# EAGLE design controller_board (EAGLE 9.6.2)
Assembly variants: Minimal, FullAwesome
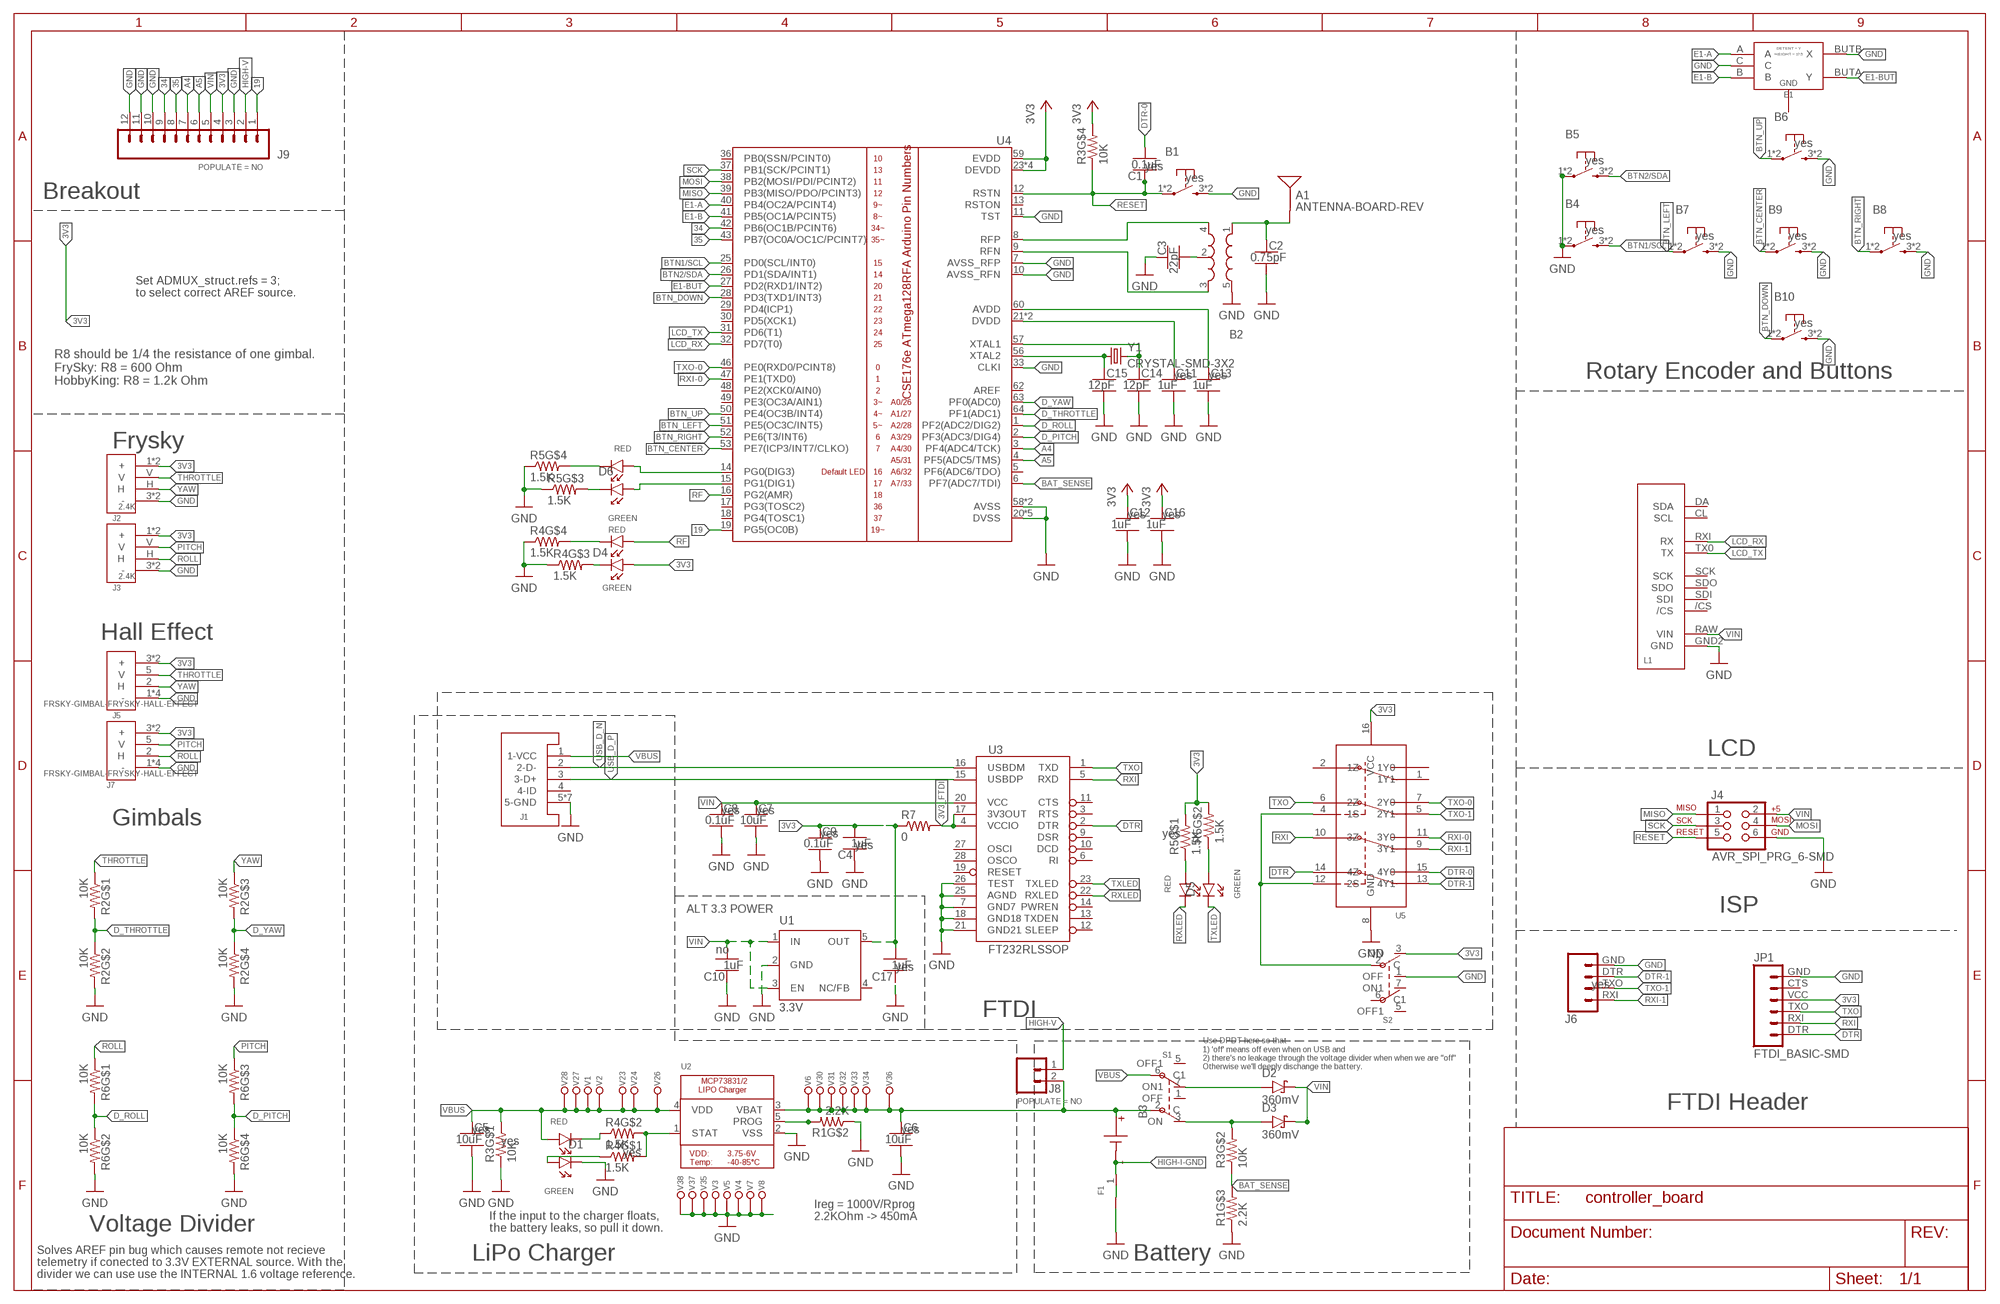
[diagram p0: schematic, sheet 1]
FRAME1 (FRAME_B_L): CREATOR: Unknown; DIST: Unknown; DISTPN: Unknown

## Parts
A1  ANTENNA-BOARD-REV  [ANT_PCB_2.4GHZ_NRF8001_1.6MM_1OZ_REV]
B1  PUSHBUTTON_-4.5X4.5  [4.5MM_TACTILE_SWITCH_TL3305AF160QG]
B2  BALUN0805  [BALUN]
B3  BATTERY-SCREW-TERMINAL  [SCREW-TERMINAL-1X2-2.54MM]
B4  PUSHBUTTON_-4.5X4.5  [4.5MM_TACTILE_SWITCH_TL3305AF160QG]  (not fitted in variant Minimal)
B5  PUSHBUTTON_-4.5X4.5  [4.5MM_TACTILE_SWITCH_TL3305AF160QG]  (not fitted in variant Minimal)
B6  PUSHBUTTON_-4.5X4.5  [4.5MM_TACTILE_SWITCH_TL3305AF160QG]
B7  PUSHBUTTON_-4.5X4.5  [4.5MM_TACTILE_SWITCH_TL3305AF160QG]
B8  PUSHBUTTON_-4.5X4.5  [4.5MM_TACTILE_SWITCH_TL3305AF160QG]
B9  PUSHBUTTON_-4.5X4.5  [4.5MM_TACTILE_SWITCH_TL3305AF160QG]
B10  PUSHBUTTON_-4.5X4.5  [4.5MM_TACTILE_SWITCH_TL3305AF160QG]
C1  0.1uF  CAPACITOR-NP_SMD-0603_CERAMIC-0.1UF  [CAPC1608X100]
C2  0.75pF  CAPACITOR-NP_SMD-0603_CERAMIC-0.75PF  [CAPC1608X100]
C3  22pF  CAPACITOR-NP_SMD-0603_CERAMIC-22PF  [CAPC1608X100]
C4  1uF  CAPACITOR-NP_SMD-0603_CERAMIC-1UF  [CAPC1608X100]
C5  10uF  CAPACITOR-NP_SMD-0603_CERAMIC-10UF  [CAPC1608X100]
C6  10uF  CAPACITOR-NP_SMD-0603_CERAMIC-10UF  [CAPC1608X100]
C7  10uF  CAPACITOR-NP_SMD-0603_CERAMIC-10UF  [CAPC1608X100]  (not fitted in variant Minimal)
C8  0.1uF  CAPACITOR-NP_SMD-0603_CERAMIC-0.1UF  [CAPC1608X100]  (not fitted in variant Minimal)
C9  0.1uF  CAPACITOR-NP_SMD-0603_CERAMIC-0.1UF  [CAPC1608X100]  (not fitted in variant Minimal)
C10  1uF  CAPACITOR-NP_SMD-0603_CERAMIC-1UF  [CAPC1608X100]
C11  1uF  CAPACITOR-NP_SMD-0603_CERAMIC-1UF  [CAPC1608X100]
C12  1uF  CAPACITOR-NP_SMD-0603_CERAMIC-1UF  [CAPC1608X100]
C13  1uF  CAPACITOR-NP_SMD-0603_CERAMIC-1UF  [CAPC1608X100]
C14  12pF  CAPACITOR-NP_SMD-0603_CERAMIC-12PF  [CAPC1608X100]
C15  12pF  CAPACITOR-NP_SMD-0603_CERAMIC-12PF  [CAPC1608X100]
C16  1uF  CAPACITOR-NP_SMD-0603_CERAMIC-1UF  [CAPC1608X100]
C17  1uF  CAPACITOR-NP_SMD-0603_CERAMIC-1UF  [CAPC1608X100]
D1  LED-2X-GREEN/RED-1.6X1.5MM  [LED-2X-LITE-ON-1.6MMX1.5MM]
D2  360mV  DIODE-SCHOTTKY_-SMD-SOD123  [SODFL3516X96]
D3  360mV  DIODE-SCHOTTKY_-SMD-SOD123  [SODFL3516X96]
D4  LED-2X-GREEN/RED-1.6X1.5MM  [LED-2X-LITE-ON-1.6MMX1.5MM]
D5  LED-2X-GREEN/RED-1.6X1.5MM  [LED-2X-LITE-ON-1.6MMX1.5MM]  (not fitted in variant Minimal)
D6  LED-2X-GREEN/RED-1.6X1.5MM  [LED-2X-LITE-ON-1.6MMX1.5MM]
E1  ROTARY-ENCODER-W/BUTTON-BOURNS-PEC12R-4217F  [BOURNS-PEC12R]
F1  SHORT  [SHORT]
J1  USB-MICROA-AMPHENOL-10118192-0001LF  [USB-MICROA-10118192-0001LF]  (not fitted in variant Minimal)
J2  2.4K  FRSKY-GIMBAL-FRYSKY  [JST-13-PTH]  (not fitted in variant Minimal)
J3  2.4K  FRSKY-GIMBAL-FRYSKY  [JST-13-PTH]  (not fitted in variant Minimal)
J4  AVR_SPI_PRG_6-SMD  [2X3-SMD]
J5  FRSKY-GIMBAL-FRYSKY-HALL-EFFECT  [MOLEX-0532610671]
J6  FTDI-4PIN-RIGHT-ANGLE-SMD  [HEADER-2X2-0.1IN-MALE-RIGHT-ANGLE-SMD]
J7  FRSKY-GIMBAL-FRYSKY-HALL-EFFECT  [MOLEX-0532610671]
J8  HEADER-0.1IN-2POS-SCREW  [SCREW-TERMINAL-1X2-2.54MM]
J9  HEADER-12POS-0.1IN-FEMALE-TH  [HDRVR12W75P254_1X12_3098X254X850B]
JP1  FTDI_BASIC-SMD  [FTDI-BASIC-SMD]
L1  SPARKFUN_SERLCD_SERIAL_REDUCED-SMD  [SPARKFUN_SERLCD_16X2_REDUCED_SMD]
R1  2.2K  RESISTOR-PACK-4X-2.2K  [RESCAXS50P200X100X45-8]
R2  10K  RESISTOR-PACK-4X-10K  [RESCAXS50P200X100X45-8]
R3  10K  RESISTOR-PACK-4X-10K  [RESCAXS50P200X100X45-8]
R4  1.5K  RESISTOR-PACK-4X-1.5K  [RESCAXS50P200X100X45-8]
R5  1.5K  RESISTOR-PACK-4X-1.5K  [RESCAXS50P200X100X45-8]
R6  10K  RESISTOR-PACK-4X-10K  [RESCAXS50P200X100X45-8]
R7  0  RESISTOR_SMD-0603-0  [RESC1608X55]
S1  SWITCH-DPDT-300MA-6V-SMD  [JS202011JCQN]
S2  SWITCH-DPDT-300MA-6V-SMD  [JS202011JCQN]
U1  3.3V  TPS73633-DBVT3V3-V2  [SOT23-DBV]
U2  MCP73831T-2ACI/OT  MCP73831/2  [SOT23-5]
U3  FT232RLSSOP  [SSOP28DB]  (not fitted in variant Minimal)
U4  ATMEGA128RFA1  [QFN-64]
U5  DPDT-X2  [SOP65P640X110-16]  (not fitted in variant Minimal)
V1  LOCKED-VIA-0.2  [VIA-0.2MM]
V2  LOCKED-VIA-0.2  [VIA-0.2MM]
V3  LOCKED-VIA-0.2  [VIA-0.2MM]
V4  LOCKED-VIA-0.2  [VIA-0.2MM]
V5  LOCKED-VIA-0.2  [VIA-0.2MM]
V6  LOCKED-VIA-0.2  [VIA-0.2MM]
V7  LOCKED-VIA-0.2  [VIA-0.2MM]
V8  LOCKED-VIA-0.2  [VIA-0.2MM]
V23  LOCKED-VIA-0.2  [VIA-0.2MM]
V24  LOCKED-VIA-0.2  [VIA-0.2MM]
V26  LOCKED-VIA-0.2  [VIA-0.2MM]
V27  LOCKED-VIA-0.2  [VIA-0.2MM]
V28  LOCKED-VIA-0.2  [VIA-0.2MM]
V30  LOCKED-VIA-0.2  [VIA-0.2MM]
V31  LOCKED-VIA-0.2  [VIA-0.2MM]
V32  LOCKED-VIA-0.2  [VIA-0.2MM]
V33  LOCKED-VIA-0.2  [VIA-0.2MM]
V34  LOCKED-VIA-0.2  [VIA-0.2MM]
V35  LOCKED-VIA-0.2  [VIA-0.2MM]
V36  LOCKED-VIA-0.2  [VIA-0.2MM]
V37  LOCKED-VIA-0.2  [VIA-0.2MM]
V38  LOCKED-VIA-0.2  [VIA-0.2MM]
Y1  CRYSTAL-SMD-3X2  [OSCCC320X250X85]

## Nets
3V3: C4.2 C9.1 C12.1 C16.1 C17.2 D4.A1 J2.1(+) J2.4(+) J3.1(+) J3.4(+) J5.3(+) J5.6(+) J7.3(+) J7.6(+) J9.4 JP1.VCC R3.8 R5.5 R5.6 R7.1 S2.3(ON) U1.5(OUT) U4.23(DEVDD) U4.34(DEVDD) U4.44(DEVDD) U4.54(DEVDD) U4.59(EVDD) U5.16(VCC)
3V3_FTDI: R7.2 U3.4(VCCIO) U3.17(3V3OUT)
19: J9.1 U4.19(PG5(OC0B))
34: J9.9 U4.42(PB6(OC1B/PCINT6))
35: J9.8 U4.43(PB7(OC0A/OC1C/PCINT7))
A4: J9.7 U4.3(PF4(ADC4/TCK))
A5: J9.6 U4.4(PF5(ADC5/TMS))
ANTENNA [RFSIG]: A1.FEED(SIGNAL) B2.1(IN) C2.1
BAT_SENSE: R1.7 R3.3 U4.6(PF7(ADC7/TDI))
BCAP: B2.2(GND) C3.2
BPOS [HIGH-I]: B3.2(P) C6.1 J8.2 S1.2(C) U2.3(VBAT) V6.P1(N) V30.P1(N) V31.P1(N) V32.P1(N) V33.P1(N) V34.P1(N) V36.P1(N)
BTN1/SCL: B4.3 B4.4 U4.25(PD0(SCL/INT0))
BTN2/SDA: B5.3 B5.4 U4.26(PD1(SDA/INT1))
BTN_CENTER: B9.1 B9.2 U4.53(PE7(ICP3/INT7/CLKO))
BTN_DOWN: B10.1 B10.2 U4.28(PD3(TXD1/INT3))
BTN_LEFT: B7.1 B7.2 U4.51(PE5(OC3C/INT5))
BTN_RIGHT: B8.1 B8.2 U4.52(PE6(T3/INT6))
BTN_UP: B6.1 B6.2 U4.50(PE4(OC3B/INT4))
CLK_NEG: C15.1 U4.56(XTAL2) Y1.1
CLK_POS: C14.1 U4.57(XTAL1) Y1.3
D_PITCH: R6.1 R6.7 U4.2(PF3(ADC3/DIG4))
D_ROLL: R6.3 R6.5 U4.1(PF2(ADC2/DIG2))
D_THROTTLE: R2.3 R2.5 U4.64(PF1(ADC1))
D_YAW: R2.1 R2.7 U4.63(PF0(ADC0))
DTR: JP1.DTR U3.2(DTR) U5.14(4Z)
DTR-0: C1.2 U5.15(4Y0)
DTR-1: J6.DTR U5.13(4Y1)
E1-A: E1.A U4.40(PB4(OC2A/PCINT4))
E1-B: E1.B U4.41(PB5(OC1A/PCINT5))
E1-BUT: E1.BUTA(Y) U4.27(PD2(RXD1/INT2))
GND: B1.3 B1.4 B2.5(GND) B4.1 B4.2 B5.1 B5.2 B6.3 B6.4 B7.3 B7.4 B8.3 B8.4 B9.3 B9.4 B10.3 B10.4 C2.2 C3.1 C4.1 C5.2 C6.2 C7.2 C8.2 C9.2 C10.1 C11.2 C12.2 C13.2 C14.2 C15.2 C16.2 C17.1 D1.C1 E1.BUTB(X) E1.C F1.2(B) J1.5(5-GND) J1.6(5-GND) J1.7(5-GND) J1.8(5-GND) J1.9(5-GND) J1.10(5-GND) J1.11(5-GND) J2.3(-) J2.6(-) J3.3(-) J3.6(-) J4.6 J5.1(-) J5.4(-) J5.G1(-) J5.G2(-) J6.GND J7.1(-) J7.4(-) J7.G1(-) J7.G2(-) J9.3 J9.10 J9.11 J9.12 JP1.GND L1.GND2(GND) R1.2 R1.3 R2.6 R2.8 R3.4 R4.1 R4.2 R5.1 R5.2 R6.6 R6.8 S2.1(OFF) U1.2(GND) U2.2(VSS) U3.7(GND7) U3.18(GND18) U3.21(GND21) U3.25(AGND) U3.26(TEST) U4.7(AVSS_RFP) U4.10(AVSS_RFN) U4.11(TST) U4.20(DVSS) U4.24(DVSS) U4.33(CLKI) U4.35(DVSS) U4.45(DVSS) U4.55(DVSS) U4.58(AVSS) U4.61(AVSS) U5.8(GND) V3.P1(N) V4.P1(N) V5.P1(N) V7.P1(N) V8.P1(N) V35.P1(N) V37.P1(N) V38.P1(N)
HIGH-I-GND [HIGH-I]: B3.1(N) F1.1(A)
HIGH-V [HIGH-I]: J8.1 J9.2
LCD_RX: L1.RXI(RX) U4.32(PD7(T0))
LCD_TX: L1.TX0(TX) U4.31(PD6(T1))
MISO: J4.1 U4.39(PB3(MISO/PDO/PCINT3))
MOSI: J4.4 U4.38(PB2(MOSI/PDI/PCINT2))
N$1: D1.A1 R4.4
N$2: D1.C2 R4.3
N$3: D5.A1 R5.3
N$4: D6.C2 R5.8
N$5: D6.C1 R5.7
N$6: D4.C1 R4.7
N$7: D5.A2 R5.4
N$8: D6.A2 U4.14(PG0(DIG3))
N$9: D6.A1 U4.15(PG1(DIG1))
N$11: R4.5 R4.6 U2.1(STAT)
N$12: R1.6 U2.5(PROG)
N$13: D4.C2 R4.8
N$14 [HIGH-I]: D2.2(A) S1.7(ON1)
N$20: C11.1 U4.21(DVDD) U4.22(DVDD)
N$21: C13.1 U4.60(AVDD)
PITCH: J3.V J7.5(V) R6.2
PROG_SEL: S2.2(C) U5.4(1S) U5.12(2S)
RESET: B1.1 B1.2 C1.1 J4.5 R3.1 U4.12(RSTN)
RF: D4.A2 U4.16(PG2(AMR))
RF_N: B2.3(OUT2) U4.9(RFN)
RF_P: B2.4(OUT1) U4.8(RFP)
ROLL: J3.H J7.2(H) R6.4
RXI: JP1.RXI U3.5(RXD) U5.10(3Z)
RXI-0: U4.47(PE1(TXD0)) U5.11(3Y0)
RXI-1: J6.RXI U5.9(3Y1)
RXLED: D5.C2 U3.22(RXLED)
SCK: J4.3 U4.37(PB1(SCK/PCINT1))
THROTTLE: J2.V J5.5(V) R2.4
TXLED: D5.C1 U3.23(TXLED)
TXO: JP1.TXO U3.1(TXD) U5.6(2Z)
TXO-0: U4.46(PE0(RXD0/PCINT8)) U5.7(2Y0)
TXO-1: J6.TXO U5.5(2Y1)
USB_D_N: J1.2(2-D-) U3.16(USBDM)
USB_D_P: J1.3(3-D+) U3.15(USBDP)
VBAT [HIGH-I]: D3.2(A) R3.6 S1.3(ON)
VBUS [HIGH-I]: C5.1 D1.A2 J1.1(1-VCC) R3.5 S1.6(C1) U2.4(VDD) V1.P1(N) V2.P1(N) V23.P1(N) V24.P1(N) V26.P1(N) V27.P1(N) V28.P1(N)
VIN [HIGH-I]: C7.1 C8.1 C10.2 D2.1(C) D3.1(C) J4.2 J9.5 L1.RAW(VIN) U1.1(IN) U1.3(EN) U3.20(VCC)
YAW: J2.H J5.2(H) R2.2
Unconnected: E1.G1(GND) E1.G2(GND) J1.4(4-ID) JP1.CTS L1./CS L1.CL(SCL) L1.DA(SDA) L1.SCK L1.SDI L1.SDO R1.1 R1.4 R1.5 R1.8 R3.2 R3.7 S1.1(OFF) S1.5(OFF1) S2.5(OFF1) S2.6(C1) S2.7(ON1) U1.4(NC/FB) U3.3(RTS) U3.6(RI) U3.9(DSR) U3.10(DCD) U3.11(CTS) U3.12(SLEEP) U3.13(TXDEN) U3.14(PWREN) U3.19(RESET) U3.27(OSCI) U3.28(OSCO) U4.5(PF6(ADC6/TDO)) U4.13(RSTON) U4.17(PG3(TOSC2)) U4.18(PG4(TOSC1)) U4.29(PD4(ICP1)) U4.30(PD5(XCK1)) U4.36(PB0(SSN/PCINT0)) U4.48(PE2(XCK0/AIN0)) U4.49(PE3(OC3A/AIN1)) U4.62(AREF) U5.1(1Y1) U5.2(1Z) U5.3(1Y0)

## Notes on the sheet
- Breakout
- Set ADMUX_struct.refs = 3;
  to select correct AREF source.
- Rotary Encoder and Buttons
- R8 should be 1/4 the resistance of one gimbal.
  FrySky: R8 = 600 Ohm
  HobbyKing: R8 = 1.2k Ohm
- Frysky
- Hall Effect
- LCD
- Gimbals
- ALT 3.3 POWER | ISP
- FTDI
- Use DPDT here so that 
  1) 'off' means off even when on USB and 
  2) there's no leakage through the voltage divider when when we are "off"  
  Otherwise we'll deeply dischange the battery.
- FTDI Header
- Ireg = 1000V/Rprog
  2.2KOhm -> 450mA
- Voltage Divider
- If the input to the charger floats, 
  the battery leaks, so pull it down.
- LiPo Charger | Battery
- Solves AREF pin bug which causes remote not recieve 
  telemetry if conected to 3.3V EXTERNAL source. With the 
  divider we can use use the INTERNAL 1.6 voltage reference.

## Library data of the parts
A1 = quadparts_prebuilt:ANTENNA: Single endded antenna.; CREATOR: Swanson; DESC: trace antenna; DIST: NA; DISTPN: NA; MFR: NA; MOUNTING: NONE; MPN: NA; POPULATE: NO
B1 B4-B10 = quadparts_prebuilt:PUSHBUTTON_: "Tactile" or "clicky" button.; CREATOR: Swanson; DESC: SWITCH TACTILE SPST-NO 50MA 12V; DIST: DIGIKEY; DISTPN: EG5350CT-ND; MFR: E-Switch; MOUNTING: SMD; MPN: TL3305AF160QG; SUBSTITUTE_OK: yes
B2 = quadparts_prebuilt:BALUN: A balun to convert differential radio-frequency outputs from the microcontroller into a single-ended driver for the antenna.; CREATOR: Swanson; DATASHEET: http://katalog.we-online.de/pbs/datasheet/748421245.pdf; DESC: BALUN 2.4GHZ-2.5GHZ 50/100 0805; DIST: Digikey; DISTPN: 732-2230-1-ND; MFR: Wurth Electronics Inc.; MOUNTING: SMD; MPN: 748421245; PACKAGE: 0805; PRICE: 2.63; REVIEWER: Swanson
B3 = quadparts_prebuilt_2022:BATTERY: Connections for a battery.; CREATOR: Swanson; DIST: DIGIKEY; DISTPN: ED10561-ND; MOUNTING: TH; PIN1: -; PIN2: +
C1 C8 C9 = quadparts_prebuilt:CAPACITOR-NP_: Nonpolarized capacitor; CREATOR: Swanson; DESC: CAP CER 0.1UF 10V X7R 0603; DIST: Digikey; DISTPN: 399-1095-1-ND; MFR: KEMET; MOUNTING: SMD; MPN: C0603C104K8RACTU; PACKAGE: 0603; SUBSTITUTE_OK: yes
C2 = quadparts_prebuilt:CAPACITOR-NP_: Nonpolarized capacitor; CREATOR: Swanson; DESC: CAP CER 0.75PF 50V NPO 0603; DIST: Digikey; DISTPN: 311-3843-1-ND; MFR: Yageo; MOUNTING: SMD; MPN: CC0603BRNPO9BNR75; PACKAGE: 0603
C3 = quadparts_prebuilt:CAPACITOR-NP_: Nonpolarized capacitor; CREATOR: Swanson; DESC: CAP CER 22PF 6.3V NP0 0603; DIST: Digikey; DISTPN: 478-11384-1-ND; MFR: AVX Corporation; MOUNTING: SMD; MPN: 06036A220KAT2A; PACKAGE: 0603
C4 C11-C13 C16 C17 = quadparts_prebuilt:CAPACITOR-NP_: Nonpolarized capacitor; CREATOR: Swanson; DESC: CAP CER 1UF 10V X5R 0603; DIST: Digikey; DISTPN: 1276-1182-1-ND; MFR: Samsung Electro-Mechanics; MOUNTING: SMD; MPN: CL10A105KP8NNNC; PACKAGE: 0603; SUBSTITUTE_OK: yes
C5-C7 = quadparts_prebuilt:CAPACITOR-NP_: Nonpolarized capacitor; CREATOR: Swanson; DESC: CAP CER 10UF 6.3V X5R 0603; DIST: Digikey; DISTPN: 1276-1119-1-ND; MFR: Samsung Electro-Mechanics; MOUNTING: SMD; MPN: CL10A106MQ8NNNC; PACKAGE: 0603; SUBSTITUTE_OK: yes
C10 = quadparts_prebuilt:CAPACITOR-NP_: Nonpolarized capacitor; CREATOR: Swanson; DESC: CAP CER 1UF 10V X5R 0603; DIST: Digikey; DISTPN: 1276-1182-1-ND; MFR: Samsung Electro-Mechanics; MOUNTING: SMD; MPN: CL10A105KP8NNNC; PACKAGE: 0603; SUBSTITUTE_OK: no
C14 C15 = quadparts_prebuilt:CAPACITOR-NP_: Nonpolarized capacitor; CREATOR: Swanson; DESC: CAP CER 12PF 10V C0G/NP0 0603; DIST: Digikey; DISTPN: 720-1655-1-ND; MFR: Vishay Vitramon; MOUNTING: SMD; MPN: VJ0603A120FXQCW1BC; PACKAGE: 0603
D1 D4-D6 = RemoteParts:LED-2X; COLOR1: RED; COLOR2: GREEN; CREATOR: Swanson; DESC: LED GREEN/RED CLEAR CHIP SMD; DIST: DIGIKEY; DISTPN: 160-2252-1-ND; MFR: Lite-On Inc.; MOUNTING: SMD; MPN: LTST-C195TGKRKT; PACKAGE: 4SMD
D2 D3 = quadparts_prebuilt:DIODE-SCHOTTKY_: Schottky diode; CREATOR: Swanson; DESC: DIODE SCHOTTKY 30V 1.5A SFLAT; DIST: Digikey; DISTPN: CRS08QMCT-ND; MFR: Toshiba Semiconductor and Storage; MOUNTING: SMD; MPN: CRS08(TE85L,Q,M); REVIEWER: Swanson
E1 = RemoteParts:ROTARY-ENCODER-W/BUTTON; AUX1DIST: DIGIKEY; AUX1DISTPN: 1722-1241-ND; AUX1MFR: Davies Molding, LLC; AUX1MPN: 1221-J; CREATOR: Swanson; DESC: ROTARY ENCODER MECHANICAL 24PPR; DETENT: Y; DIST: DIGIKEY; DISTPN: PEC12R-4217F-S0024-ND; HEIGHT: 17.5; MFR: Bourns Inc.; MOUNTING: TH; MPN: PEC12R-4217F-S0024; SUBSTITUTE_OK: NO
F1 = RemoteParts:SHORT; CREATOR: Swanson; DESC: NA; DIST: NA; DISTPN: NA; MFR: NA; MOUNTING: NONE; MPN: NA; POPULATE: NO
J1 = RemoteParts:USB; CREATOR: Swanson; DESC: CONN RCPT USB2.0 MICRO B SMD R/A; DIST: DIGIKEY; DISTPN: 609-4613-1-ND; MFR: Amphenol ICC (FCI); MOUNTING: SMD; MPN: 10118192-0001LF
J2 = RemoteParts:FRSKY-GIMBAL; CREATOR: Swanson; DESC: CONN HEADER VERT 12POS 2MM; DIST: Digikey; DISTPN: A100106-ND; MFR: TE Connectivity AMP Connectors; MOUNTING: TH; MPN: 1-1735446-2; POPULATE: NO
J3 = RemoteParts:FRSKY-GIMBAL; CREATOR: Swanson; DESC: CONN HEADER VERT 12POS 2MM; DIST: Digikey; DISTPN: A100106-ND; MFR: TE Connectivity AMP Connectors; MOUNTING: TH; MPN: 1-1735446-2; POPULATE: NO; SPICEPREFIX: E
J4 = quadparts_prebuilt:AVR_SPI_PRG_6: AVR ISP 6 Pin This is the in-system programming (ISP) connector for Atmel Microcontrollers programming.; CREATOR: Swanson; DESC: CONN HEADER SMD 6POS 2.54MM; DIST: Digikey; DISTPN: 609-3487-2-ND; MFR: Amphenol ICC (FCI); MOUNTING: SMD; MPN: 95278-101A06LF
J5 J7 = RemoteParts:FRSKY-GIMBAL; CREATOR: Swanson; DESC: CONN HEADER SMD R/A 6POS 1.25MM; DIST: DIGIKEY; DISTPN: WM7624CT-ND; MFR: Molex; MOUNTING: SMD; MPN: 0532610671
J6 = quadparts_prebuilt:FTDI-4PIN; CREATOR: Swanson; DESC: CONN HEADER SMD R/A 4POS 2.54MM; DIST: DIGIKEY; DISTPN: SAM15344-ND; MFR: Samtec Inc.; MOUNTING: SMD; MPN: TSM-102-01-L-DH; SUBSTITUTE_OK: yes
J8 = RemoteParts:HEADER-0.1IN-2POS: 2 pin single inline pin header, socket, or connector; CREATOR: Swanson; DESC: TERM BLK 2P SIDE ENT 2.54MM PCB; DIST: digikey; DISTPN: ED10561-ND; MFR: On Shore Technology Inc.; MOUNTING: TH; MPN: OSTVN02A150; PIN1: 1; PIN2: 2; POPULATE: NO
J9 = quadparts_prebuilt:HEADER-12POS; CREATOR: Swanson; DESC: CONN HDR 12POS 0.1 TIN PCB; DIST: DIGIKEY; DISTPN: S6100-ND; MFR: Sullins Connector Solutions; MOUNTING: TH; MPN: PPTC121LFBN-RC; POPULATE: NO
JP1 = quadparts_prebuilt:FTDI_BASIC: FTDI (USB-serial converter) header bins with labels.; CREATOR: Swanson; DESC: CONN HEADER SMD R/A 6POS 2.54MM; DIST: DIGIKEY; DISTPN: 952-3235-ND; LEFT_PIN: B; MFR: Harwin Inc.; MOUNTING: SMD; MPN: M20-8890645; RIGHT_PIN: G
L1 = RemoteParts:SPARKFUN_SERLCD_SERIAL_REDUCED; AUX1DIST: Sparkfun; AUX1DISTPN: LCD-14072; AUX1MFR: Sparkfun; AUX1MPN: LCD-14072; CREATOR: Swanson; DESC: 10 Position Header, Top or Bottom Entry Connector Surface Mount; DIST: Digikey; DISTPN: S5641-ND; MFR: Sullins Connector Solutions; MOUNTING: SMD; MPN: NPPC101KFXC-RC
R1 = quadparts_prebuilt:RESISTOR-PACK-4X; CREATOR: Swanson; DESC: RES ARRAY 4 RES 2.2K OHM 0804; DIST: DIGIKEY; DISTPN: Y10222CT-ND; MFR: Panasonic Electronic Components; MOUNTING: SMD; MPN: EXB-N8V222JX; SUBSTITUTE_OK: yes
R2 R6 = quadparts_prebuilt_2022:RESISTOR-PACK-4X; CREATOR: Swanson; DESC: RES ARRAY 4 RES 10K OHM 0804; DIST: DIGIKEY; DISTPN: Y10103CT-ND; MFR: Panasonic Electronic Components; MOUNTING: SMD; MPN: EXB-N8V103JX; PACKAGE: 0804
R3 = quadparts_prebuilt:RESISTOR-PACK-4X; CREATOR: Swanson; DESC: RES ARRAY 4 RES 10K OHM 0804; DIST: DIGIKEY; DISTPN: Y10103CT-ND; MFR: Panasonic Electronic Components; MOUNTING: SMD; MPN: EXB-N8V103JX; PACKAGE: 0804; SUBSTITUTE_OK: yes
R4 R5 = quadparts_prebuilt:RESISTOR-PACK-4X; CREATOR: Swanson; DESC: RES ARRAY 4 RES 1.5K OHM 0804; DIST: DIGIKEY; DISTPN: Y10152CT-ND; MFR: Panasonic Electronic Components; MOUNTING: SMD; MPN: EXB-N8V152JX; SUBSTITUTE_OK: yes
R7 = quadparts_prebuilt_2022:RESISTOR_: Resistor; CREATOR: J Garza; DESC: RES 0 OHM JUMPER 1/10W 0603; DIST: DIGIKEY; DISTPN: 311-0.0GRCT-ND; MFR: Yageo; MOUNTING: SMD; MPN: RC0603JR-070RL; PACKAGE: 0603
S1 S2 = RemoteParts:SWITCH-DPDT; CREATOR: Swanson; DESC: SWITCH SLIDE DPDT 300MA 6V; DIST: DIGIKEY; DISTPN: CKN10723CT-ND; MFR: C&K; MOUNTING: SMD; MPN: JS202011JCQN
U1 = quadparts_prebuilt_2022:TPS73633-DBVT: LP3985-series voltage regulators.; CREATOR: J Garza; DESC: IC REG LINEAR 3.3V 150MA SC70-5; DIST: DIGIKEY; DISTPN: 296-35211-1-ND; MFR: Texas Instruments; MOUNTING: SMD; MPN: LP5951MGX-3.3/NOPB; PACKAGE: SOT-23
U2 = RemoteParts:MCP73831/2: MCP73831/2 LIPO Charger VDD: 3.75 - 6V Temp -40 - 85°C Programmable Charge Rate: 15-500mA NOTE: STAT is a tri-state logic output on the MCP73831 and an open-drain output on the MCP73832. SOT23-5 with 4.2V output and tri-state logic on STAT = MCP73831T-2ACI/OT; CREATOR: Adafruit; DESC: IC CONTROLLR LI-ION 4.2V SOT23-5; DIST: DIGIKEY; DISTPN: MCP73831T-2ACI/OTCT-ND; MFR: Microchip Technology; MOUNTING: SMD; MPN: MCP73831T-2ACI/OT; PACKAGE: SOT23-5
U3 = RemoteParts:FT232RL: USB UART FT232RL 4th Generation USB UART (USB <-> Serial) Controller. Spark Fun Electronics SKU : COM-00650; CREATOR: Swanson; DESC: IC USB FS SERIAL UART 28-SSOP; DIST: DIGIKEY; DISTPN: 768-1007-1-ND; MFR: FTDI; MOUNTING: SMD; MPN: FT232RL-REEL
U4 = quadparts_prebuilt:ATMEGA128RFA1: ATmega128RFA1 8-bit AVR Microcontroller with Low Power 2.4GHz Transceiver for ZigBee and IEEE 802.15.4; CREATOR: Swanson; DATASHEET: http://www.atmel.com/Images/Atmel-8266-MCU_Wireless-ATmega128RFA1_Datasheet.pdf; DESC: IC RF TXRX+MCU 802.15.4 64VFQFN; DIST: Digikey; DISTPN: ATMEGA128RFA1-ZU-ND; MFR: Microchip Technology; MOUNTING: SMD; MPN: ATMEGA128RFA1-ZU; PACKAGE: QFN; PRICE: 10.21; REVIEWER: Swanson
U5 = RemoteParts:DPDT-X2; CREATOR: Swanson; DESC: IC ANALOG SWITCH DPDT 16TSSOP; DIST: DIGIKEY; DISTPN: 568-5300-1-ND; MFR: NXP USA Inc.; MOUNTING: SMD; MPN: NX3L2467PW,118
V1-V8 V23 V24 V26-V28 V30-V38 = quadparts_prebuilt:LOCKED-VIA: A via that be removed via ripup.; CREATOR: Swanson; DIST: NA; DISTPN: NA; MFR: NA; MFRPN: NA; MOUNTING: NONE; POPULATE: NO
Y1 = quadparts_prebuilt:CRYSTAL: Crystals to provide clock references for microcontrollers, etc.; CREATOR: Swanson; DESC: CRYSTAL 16.0000MHZ 18PF SMD; DIST: DIGIKEY; DISTPN: 535-9134-1-ND; MFR: Abracon LLC; MOUNTING: SMD; MPN: ABM8-16.000MHZ-B2-T

## Net classes
1 HIGH-I: width 0.508 mm, drill 0.381 mm
2 RFSIG: width 1.016 mm

## Board
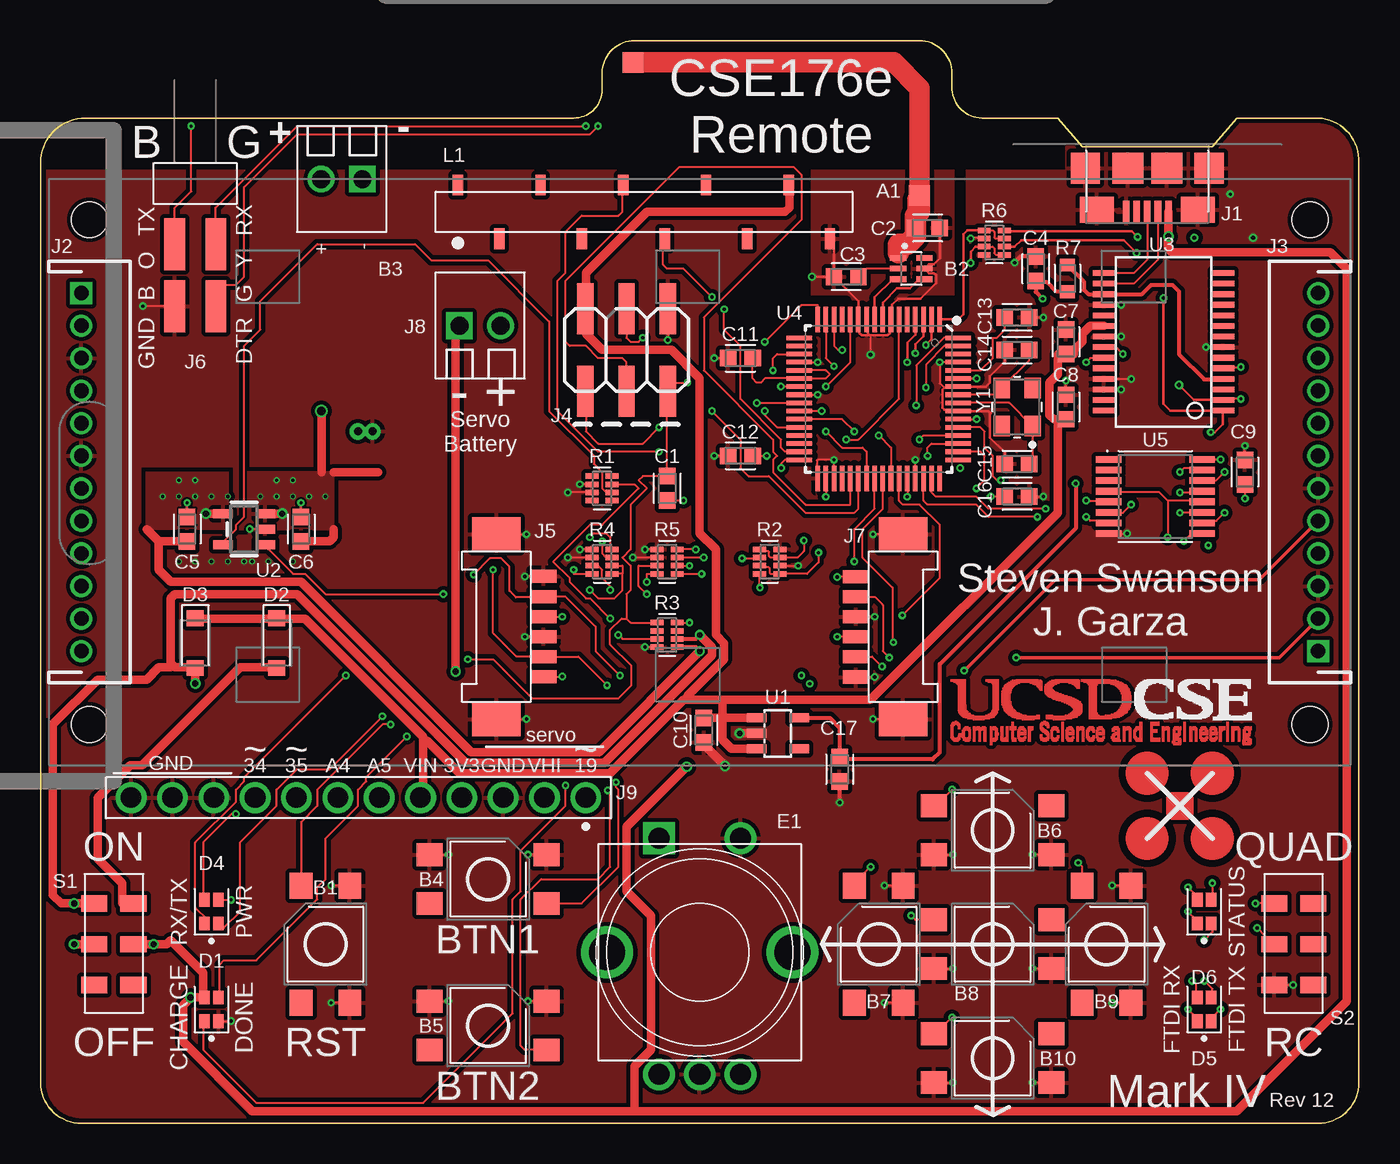
[diagram p1: board, top side]
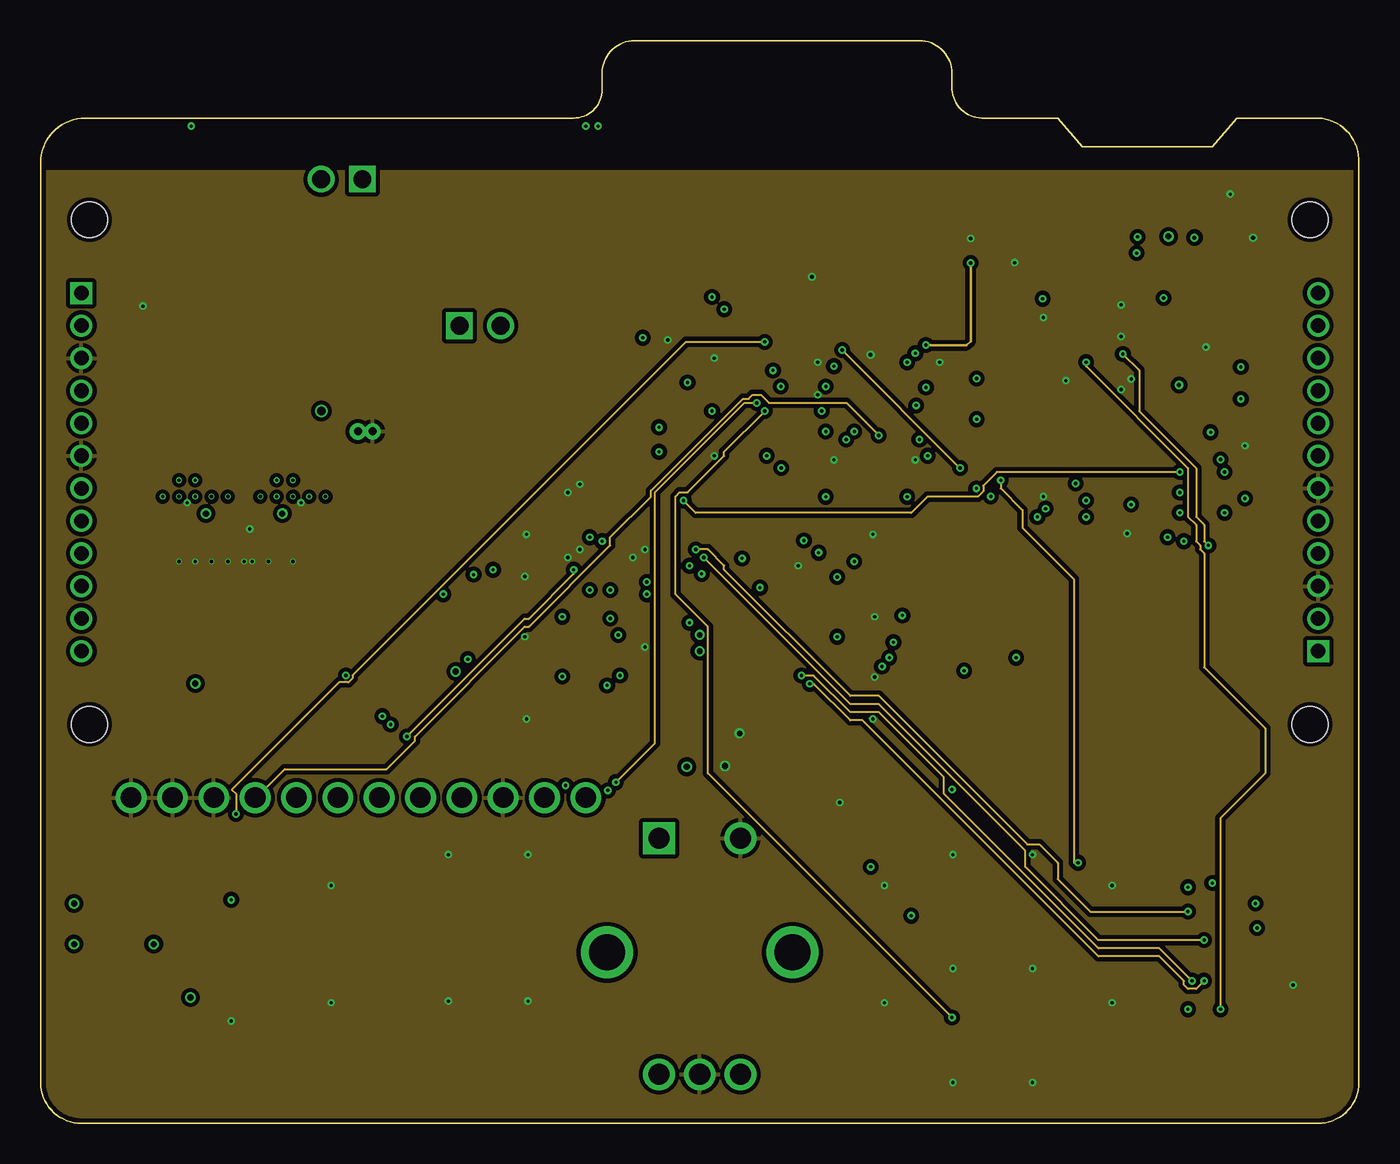
[diagram p2: board, inner layer Route2]
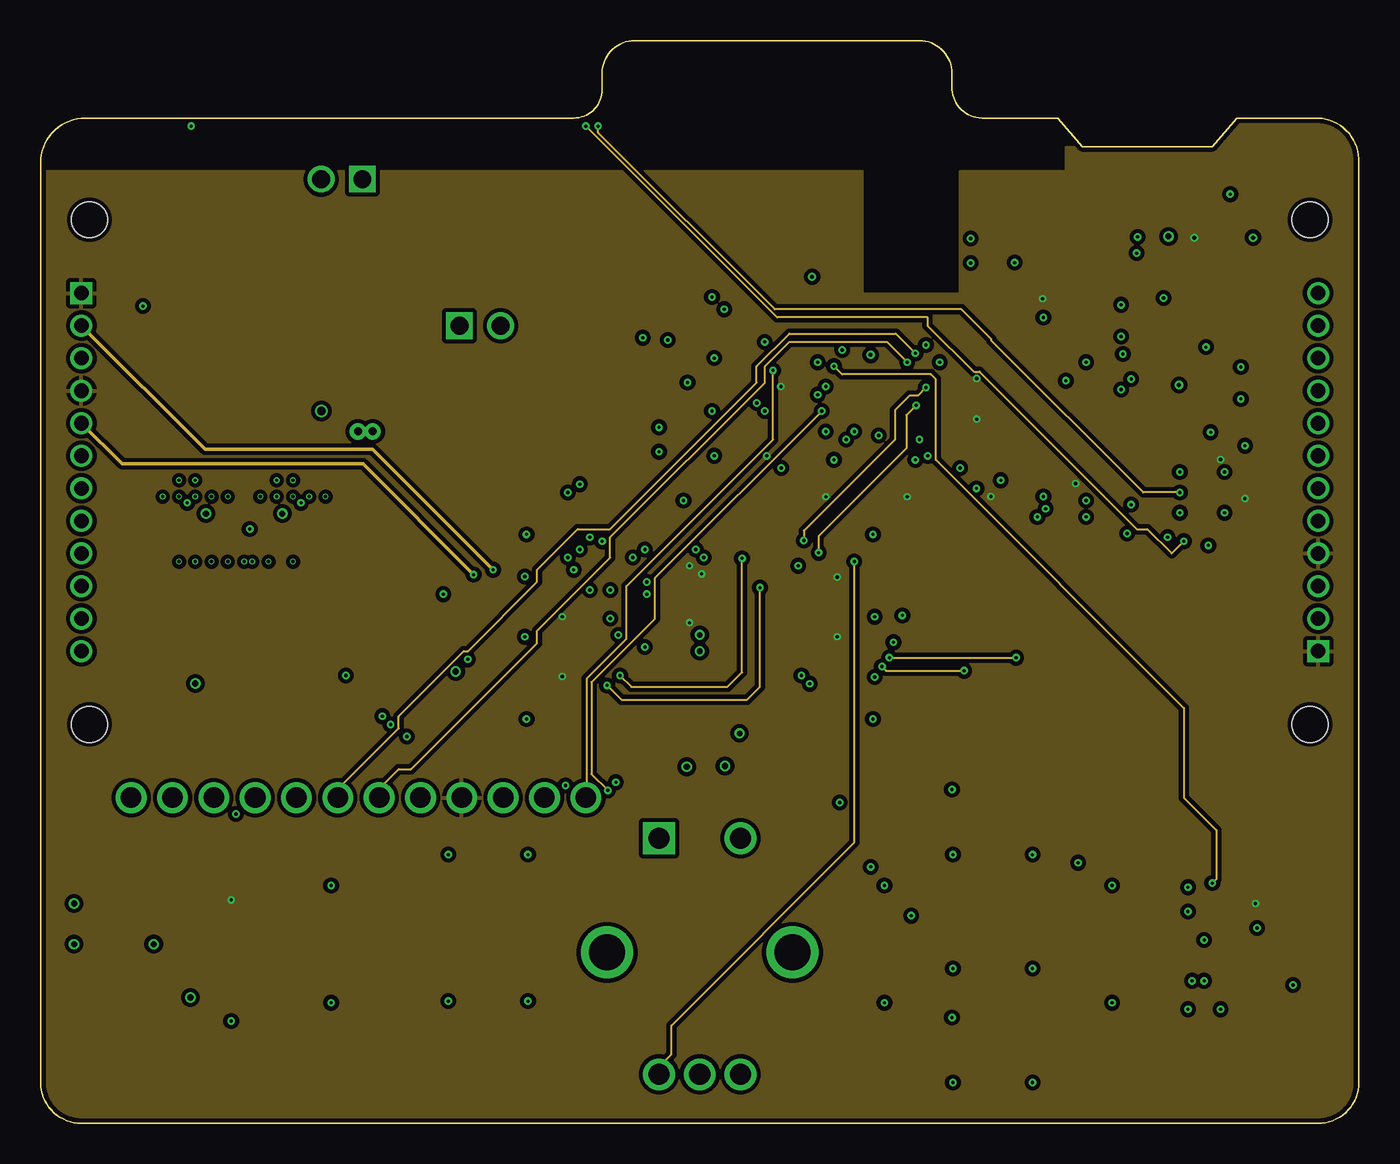
[diagram p3: board, inner layer Route15]
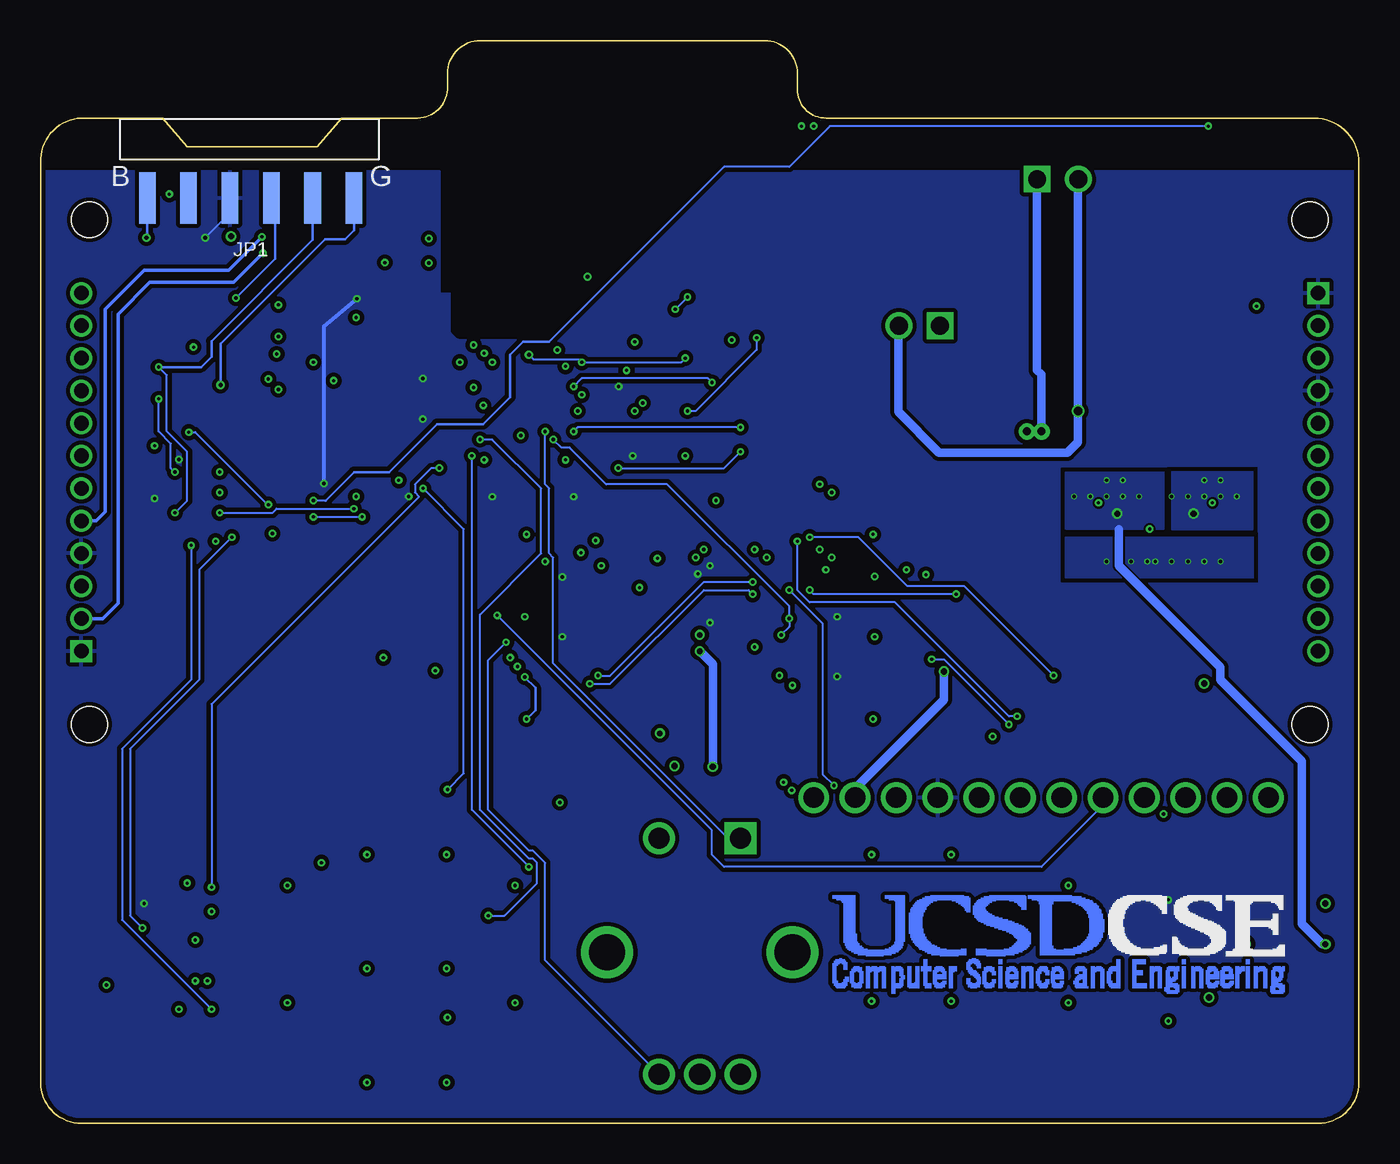
[diagram p4: board, bottom side, seen from below]

Size 81 x 66.5 mm. Coordinates in mm from the lower left corner, seen from the top.
Outline: 2.5,0 78.5,0 arc90 81,2.5 81,59 arc90 78.5,61.75 73.5,61.75 72,60 64,60 62.5,61.75 58,61.75 arc-90 56,63.5 56,64.5 arc90 54,66.5 36.5,66.5 arc90 34.5,64.5 34.5,63.5 arc-90 32.75,61.75 2.75,61.75 arc90 0,59 0,2.5 arc90 2.5,0
Copper layers (1*2*15*16): Top 0.035559375mm / dielectric 1.501140625mm / Route2 0.035559375mm / dielectric 0.149859375mm / Route15 0.035559375mm / dielectric 0.200659375mm / Bottom 0.035559375mm
Design rules "jlcpcb-4layer-5mil-small-cream": minimum track width 5mil, minimum drill 0.2mm, track to track 5mil, track to pad 5mil, pad to pad 5mil, via to via 5mil, smd to smd 5mil, copper to edge 0.2mm, drill to drill 10mil, minimum pad ring 3mil, minimum via ring 5mil, stop-mask expansion 0.05mm, vias tented up to drill 0.45mm, thermal gap 10mil
tRestrict: 7 lines
bRestrict: area 35,48.5 to 55.5,66.5

### Footprints (pad centres in the part's own frame; a part is rotated, then mirrored left to right if it is on the bottom)
ANT_PCB_2.4GHZ_NRF8001_1.6MM_1OZ_REV = smd 1.27 x 1.27: FEED 0,0; TESTPOINT 8.169,17.605
4.5MM_TACTILE_SWITCH_TL3305AF160QG = smd 1.6 x 1.4: 1 -3.6,-1.5; 2 3.6,-1.5; 3 -3.6,1.5; 4 3.6,1.5
BALUN = smd 0.35 x 1: 1 -0.65,-0.8; 2 0,-0.8; 3 0.65,-0.8; 4 0.65,0.8; 5 0,0.8; 6 -0.65,0.8
SCREW-TERMINAL-1X2-2.54MM = drill 1.1 square: 1 -1.27,0 | drill 1.1: 2 1.27,0
CAPC1608X100 = smd 1.009 x 1.015: 1 -0.753,0; 2 0.753,0
LED-2X-LITE-ON-1.6MMX1.5MM = smd 0.85 x 0.65: A1 -0.725,0.425; A2 -0.725,-0.425; C1 0.725,0.425; C2 0.725,-0.425
SODFL3516X96 = smd 0.962 x 1.029: 1 -1.525,0; 2 1.525,0
BOURNS-PEC12R = drill 1.3: A -2.5,-7.5; B 2.5,-7.5; BUTB 2.5,7; C 0,-7.5 | drill 1.3 square: BUTA -2.5,7 | drill 2.2: G1 -5.7,0; G2 5.7,0
FRSKY-TARANIS-GIMBAL = hole 3: -27,-27; -27,27; 27,-27; 27,27; -21.5,27; 21.5,27; 21.5,-27; -21.5,-27 | hole 2.2: -27,27
SHORT = drill 0.5 pad 1: 1 0,0; 2 0.9,0
USB-MICROA-10118192-0001LF = smd 0.4 x 1.35: 1 -1.3,0; 2 -0.65,0; 3 0,0; 4 0.65,0; 5 1.3,0 | smd 2.1 x 1.6: 6 3.1,-0.125; 7 -3.1,-0.125 | smd 1.8 x 1.9: 8 -3.8,-2.675; 11 3.8,-2.675 | smd 1.9 x 1.9: 9 1.2,-2.675; 10 -1.2,-2.675
JST-13-PTH = drill 0.9 square: 1 -2,0 | drill 0.9: 3 2,0; 4 4,0; 6 8,0; 7 10,0; 8 12,0; 9 14,0; 10 16,0; 11 18,0; 12 20,0; H 6,0; V 0,0
2X3-SMD = smd 1 x 3.15: 1 -2.54,-2.54; 2 -2.54,2.54; 3 0,-2.54; 4 0,2.54; 5 2.54,-2.54; 6 2.54,2.54
MOLEX-0532610671 = smd 0.8 x 1.6: 1 -3.087,2.9; 2 -1.837,2.9; 3 -0.613,2.9; 4 0.613,2.9; 5 1.837,2.9; 6 3.062,2.9 | smd 2.1 x 3: G1 -5.675,0; G2 5.675,0
HEADER-2X2-0.1IN-MALE-RIGHT-ANGLE-SMD = smd 1.27 x 3.18: DTR 1.27,-8.806; GND -1.27,-8.806; RXI 1.27,-4.996; TXO -1.27,-4.996
HDRVR12W75P254_1X12_3098X254X850B = drill 1.261 pad 1.891: 1 0,0; 2 2.54,0; 3 5.08,0; 4 7.62,0; 5 10.16,0; 6 12.7,0; 7 15.24,0; 8 17.78,0; 9 20.32,0; 10 22.86,0; 11 25.4,0; 12 27.94,0
FTDI-BASIC-SMD = smd 1.02 x 3.17: CTS -3.81,0.635; DTR 6.35,0.635; GND -6.35,0.635; RXI 3.81,0.635; TXO 1.27,0.635; VCC -1.27,0.635
SPARKFUN_SERLCD_16X2_REDUCED_SMD = smd 0.635 x 1.27: /CS -7.24,14.336; CL 0.38,17.636; DA 2.92,14.336; GND2 8,14.336; RAW 5.46,17.636; RXI -4.7,17.636; SCK -14.86,17.636; SDI -9.78,17.636; SDO -12.32,14.336; TX0 -2.16,14.336 | hole 2.2: -37.5,-15.5; -37.5,15.5; 37.5,-15.5; 37.5,15.5
RESCAXS50P200X100X45-8 = smd 0.79 x 0.339: 1 -0.62,0.75; 2 -0.62,0.25; 3 -0.62,-0.25; 4 -0.62,-0.75; 5 0.62,-0.75; 6 0.62,-0.25; 7 0.62,0.25; 8 0.62,0.75
RESC1608X55 = smd 0.788 x 0.929: 1 -0.82,0; 2 0.82,0
JS202011JCQN = smd 1 x 1.6: 1 -2.5,1.2; 2 0,1.2; 3 2.5,1.2; 5 -2.5,-1.2; 6 0,-1.2; 7 2.5,-1.2
SOT23-DBV = smd 0.55 x 1.2: 1 -0.95,-1.3; 2 0,-1.3; 3 0.95,-1.3; 4 0.95,1.3; 5 -0.95,1.3
SOT23-5 = smd 0.55 x 1.2: 1 -0.95,-1.3; 2 0,-1.3; 3 0.95,-1.3; 4 0.95,1.3; 5 -0.95,1.3
SSOP28DB = smd 0.348 x 1.397: 1 -4.225,-3.656; 2 -3.575,-3.656; 3 -2.925,-3.656; 4 -2.275,-3.656; 5 -1.625,-3.656; 6 -0.975,-3.656; 7 -0.325,-3.656; 8 0.325,-3.656; 9 0.975,-3.656; 10 1.625,-3.656; 11 2.275,-3.656; 12 2.925,-3.656; 13 3.575,-3.656; 14 4.225,-3.656; 15 4.225,3.656; 16 3.575,3.656; 17 2.925,3.656; 18 2.275,3.656; 19 1.625,3.656; 20 0.975,3.656; 21 0.325,3.656; 22 -0.325,3.656; 23 -0.975,3.656; 24 -1.625,3.656; 25 -2.275,3.656; 26 -2.925,3.656; 27 -3.575,3.656; 28 -4.225,3.656
QFN-64 = smd 1.562 x 0.28: 1 -4.881,3.75; 2 -4.881,3.25; 3 -4.881,2.75; 4 -4.881,2.25; 5 -4.881,1.75; 6 -4.881,1.25; 7 -4.881,0.75; 8 -4.881,0.25; 9 -4.881,-0.25; 10 -4.881,-0.75; 11 -4.881,-1.25; 12 -4.881,-1.75; 13 -4.881,-2.25; 14 -4.881,-2.75; 15 -4.881,-3.25; 16 -4.881,-3.75; 33 4.881,-3.75; 34 4.881,-3.25; 35 4.881,-2.75; 36 4.881,-2.25; 37 4.881,-1.75; 38 4.881,-1.25; 39 4.881,-0.75; 40 4.881,-0.25; 41 4.881,0.25; 42 4.881,0.75; 43 4.881,1.25; 44 4.881,1.75; 45 4.881,2.25; 46 4.881,2.75; 47 4.881,3.25; 48 4.881,3.75 | smd 0.28 x 1.562: 17 -3.75,-4.881; 18 -3.25,-4.881; 19 -2.75,-4.881; 20 -2.25,-4.881; 21 -1.75,-4.881; 22 -1.25,-4.881; 23 -0.75,-4.881; 24 -0.25,-4.881; 25 0.25,-4.881; 26 0.75,-4.881; 27 1.25,-4.881; 28 1.75,-4.881; 29 2.25,-4.881; 30 2.75,-4.881; 31 3.25,-4.881; 32 3.75,-4.881; 49 3.75,4.881; 50 3.25,4.881; 51 2.75,4.881; 52 2.25,4.881; 53 1.75,4.881; 54 1.25,4.881; 55 0.75,4.881; 56 0.25,4.881; 57 -0.25,4.881; 58 -0.75,4.881; 59 -1.25,4.881; 60 -1.75,4.881; 61 -2.25,4.881; 62 -2.75,4.881; 63 -3.25,4.881; 64 -3.75,4.881
SOP65P640X110-16 = smd 1.572 x 0.407: 1 -2.872,2.275; 2 -2.872,1.625; 3 -2.872,0.975; 4 -2.872,0.325; 5 -2.872,-0.325; 6 -2.872,-0.975; 7 -2.872,-1.625; 8 -2.872,-2.275; 9 2.872,-2.275; 10 2.872,-1.625; 11 2.872,-0.975; 12 2.872,-0.325; 13 2.872,0.325; 14 2.872,0.975; 15 2.872,1.625; 16 2.872,2.275
VIA-0.2MM = drill 0.2 pad 0.3: P1 0,0
OSCCC320X250X85 = smd 1.262 x 1.012: 1 -1.175,-0.95; 2 1.175,-0.95; 3 1.175,0.95; 4 -1.175,0.95

### Placement (x,y rotation side)
A1  54,57 90 top
B1  17.5,11 270 top
B2  53.5,52.5 270 top
B3  18.5,58 180 top
B4  27.5,15 180 top
B5  27.5,6 180 top
B6  58.5,18 180 top
B7  51.5,11 270 top
B8  58.5,11 180 top
B9  65.5,11 270 top
B10  58.5,4 180 top
C1  38.5,39 270 top
C2  54.5,55 0 top
C3  49.5,52 0 top
C4  61.15,52.5 270 top
C5  9,36.5 90 top
C6  16,36.5 90 top
C7  63,48 90 top
C8  63,44 90 top
C9  74,40 90 top
C10  40.75,24.15 90 top
C11  43,47 180 top
C12  43,41 180 top
C13  60,49.5 0 top
C14  60,47.5 180 top
C15  60,40.5 180 top
C16  60,38.5 0 top
C17  49.1,21.75 90 top
D1  10.5,7 270 top
D2  14.5,29.5 270 top
D3  9.5,29.5 270 top
D4  10.5,13 270 top
D5  71.5,7 270 top
D6  71.5,13 270 top
E1  40.5,10.5 0 top
E$1  [FRSKY-TARANIS-GIMBAL]  -39.5,30 0 top  (outside the outline)
E$2  [FRSKY-TARANIS-GIMBAL]  120.5,30 180 top  (outside the outline)
F1  19.5,42.5 0 top
J1  68,56 180 top
J2  2.5,49 270 top
J3  78.5,31 90 top
J4  36,47.5 0 top
J5  28,30.5 270 top
J6  9.5,59 0 top
J7  53,30.5 90 top
J8  27,49 0 top
J9  33.5,20 180 top
JP1  68.1,56.2 0 bottom
L1  40.5,40 0 top
R1  34.5,39 0 top
R2  44.8,34.5 0 top
R3  38.5,30 0 top
R4  34.5,34.5 0 top
R5  38.5,34.5 0 top
R6  58.6,54.1 180 top
R7  63.1,51.9 90 top
S1  4.5,11 90 top
S2  77,11 90 top
U1  45.3,23.95 270 top
U2  12.5,36.5 90 top
U3  69,48 90 top
U4  51.5,44.5 270 top
U5  68.5,38.5 0 top
U$1  [700MAH-BATTERY]  77,-25.5 90 top  (outside the outline)
U$2  [QUADCLASS_LOGO_SMALL]  70,19.5 0 top
U$3  [LAYER_LABELS]  39.5,-12 0 top  (outside the outline)
U$4  [375MAH-BATTERY]  -5.5,41 0 top  (outside the outline)
U$5  [600MAH-BATTERY]  41.5,82 90 top  (outside the outline)
U$6  [CSE]  18.4,10.9 0 bottom
U$7  [CSE]  65.2,25.2 0 top
V1  9.5,38.5 180 top
V2  9.5,39.5 180 top
V3  10.5,34.5 0 top
V4  15.5,34.5 180 top
V5  13,34.5 0 top
V6  15.5,38.5 180 top
V7  8.5,34.5 180 top
V8  12.5,34.5 180 top
V23  11.5,38.5 180 top
V24  7.5,38.5 180 top
V26  10.5,38.5 180 top
V27  8.5,39.5 180 top
V28  8.5,38.5 180 top
V30  15.5,39.5 180 top
V31  16.5,38.5 180 top
V32  17.5,38.5 180 top
V33  13.5,38.5 180 top
V34  14.5,39.5 180 top
V35  9.5,34.5 180 top
V36  14.5,38.5 180 top
V37  14,34.5 180 top
V38  11.5,34.5 180 top
Y1  60,44 90 top

### Tracks (layer width: path | path; a pad name or v marks a point on that pad's centre or on a via)
3V3  (via drill 0.2, 0.25)
  Top 0.127: U5.16 v72.51,40.77 | J5.3 v32.05,31.11 | J5.6 v32.05,27.44 | C9.1 v74,38.38 | J7.3 v48.95,29.89 | J7.6 v48.95,33.56 | D4.A1 v11.7,13.73 | R5.6 v39.87,34.25 | R5.5 v40.61,33.75 | R3.8 v39.87,30.75 | C12.1 v44.62,41 | U4.23 v45.48,45.25 | U4.59 v57.52,45.75 | U4.54 v57.52,43.25 | U4.44 v53.25,38.48 | U4.34 v48.25,38.48 | C16.1 v58.39,38.5 | C4.2 61.15,51.65 | S2.3 v74.65,13.5
  Top 0.254: R7.1 62.42,51.08 61.85,51.65 61.15,51.65 | v63.6,39.3 63.6,36.55 55.25,28.2 55.25,22.8 54.8,22.35 49.25,22.35 C17.2 49.1,24.3 48.5,24.9 U1.5 | C4.2 61.15,51.06 v61.56,50.65
  Bottom 0.152: JP1.VCC 69.37,55.93 v70.9,54.4
  Bottom 0.254: v61.56,50.65 63.6,48.94 v63.6,39.3
  pour Bottom (isolate 0.254, rank 4): 50.5,58.5 -7.5,58.5 -7.5,-3.5 88.5,-3.5 88.5,58.5 56.5,58.5 56.5,51 50.5,51
  pour Route15 (isolate 0.254, rank 2): -5.5,58.5 50.5,58.5 50.5,51 56.5,51 56.5,58.5 63,58.5 63,60 72,60 72,62.5 86.5,62.5 86.5,61.5 86.5,60 86.5,-1.5 -5.5,-1.5
3V3_FTDI
  Top 0.152: 63.14,52.69 R7.2
  Top 0.254: 63.14,52.69 64.1,51.72 64.1,51.2 64.38,50.92 U3.17 67.67,50.92 68.25,51.5 69.55,51.5 69.95,51.1 69.95,47.25 71.5,45.7 72.63,45.7 U3.4
19  (via drill 0.2)
  Top 0.127: U4.19 45.25,47.25 45,47 v45,46.25
  Route15 0.127: v45,46.25 45,42 36,33 36,29.75 33.55,27.3 33.55,20.55 33.5,20.5 J9.1
34  (via drill 0.2)
  Top 0.127: U4.42 52.25,41.5 v51.5,42.25
  Route2 0.127: v51.5,42.25 49.5,44.25 44.75,44.25 44.25,44.75 43.75,44.75 43.5,44.5 43.15,44.5 37.5,38.86 37.5,38.5 35,36 35,35.5 30,30.5 29.75,30.5 23,23.75 23,23.5 21.25,21.75 15,21.75 13.25,20 J9.9
35  (via drill 0.2)
  Top 0.127: U4.43 52.75,38.25 53,38 54,38 55.25,36.75 55.25,33.5 v52.95,31.2
  Bottom 0.127: v52.95,31.2 39.75,18 39.75,16.5 39,15.75 19.5,15.75 15.75,19.5 15.75,20 J9.8
A4  (via drill 0.2)
  Top 0.152: v53.75,47.3 53.75,47.85 54.25,48.35 U4.3
  Route15 0.127: v53.75,47.3 52.55,48.5 46,48.5 44,46.5 44,45.5 35,36.5 33,36.5 30.5,34 30.5,33.25 26.25,29 26,29 22,25 22,24.25 18.5,20.75 18.5,20 J9.7
A5  (via drill 0.2)
  Top 0.152: U4.4 53.75,48.45 53.25,47.95 v53.25,46.75
  Route15 0.127: v53.25,46.75 52,48 46,48 44.5,46.5 44.5,45.5 35,36 35,34.75 30.5,30.25 30.5,29.5 22.75,21.75 22,21.75 21,20.75 21,20 J9.6
ANTENNA
  Top 0.127: 52.7,53.46 B2.1
  Top 1.016: 54,56.92 A1.FEED 53.75,56.75 C2.1
  Top 1.316: 52.7,53.46 52.7,53.95 52.75,54 53.25,54 53.75,54.5 53.75,55.75 54,56 A1.FEED
BAT_SENSE  (via drill 0.2)
  Top 0.127: R3.3 35.75,29.75 v35.5,30 | v35,31 33.75,32.25 33.5,32.25 32.5,33.25 32.5,33.5 31.5,34.5 33.75,36.75 34.5,36.75 36.75,39 36.5,39.25 R1.7 | U4.6 52.75,44.5 50.25,42 v49.5,42
  Bottom 0.127: v35.5,30 35,30.5 v35,31 35,31.75 42.5,39.25 46.25,39.25 48.5,41.5 49,41.5 v49.5,42
BCAP
  Top 0.127: C3.2 50.75,52.5 B2.2
BPOS  (via drill 0.38, 0.5)
  Top 0.508: U2.3 v14.84,37.45 | S1.2 v2.06,11 | 18,36.5 18,36 17.75,35.75 C6.1 | 17.25,40 v17.25,43.75 | 18,40 20.75,40
  Bottom 0.508: 14.75,36.5 14.75,34.25 8.5,28 8.5,27.25 3.5,22.25 3.5,12.25 2.25,11 v2.06,11 | B3.2 17.25,57.98 v17.25,43.75 17.25,41.84 17.9,41.19 25.79,41.19 28.3,43.7 28.3,48.97 J8.2
  pour Top: 12,36.5 18,36.5 18,40 12,40
  pour Bottom (rank 2): 12,36.5 18,36.5 18,40 12,40
BTN1/SCL  (via drill 0.2)
  Top 0.127: v44,44.25 U4.25 | v35.35,20.95 35.35,20.65 35.5,20.5 35.5,15.75 33.25,13.5 B4.3
  Route2 0.127: v35.35,20.95 37.75,23.35 37.75,38.75 43.25,44.25 v44,44.25
BTN2/SDA  (via drill 0.2)
  Top 0.127: v48,43.75 U4.26 | v34.85,20.45 35,20.3 35,15.75 34.25,15 30.75,15 29.5,13.75 29.5,4.75 29.75,4.5 B5.3
  Route15 0.127: v48,43.75 37.75,33.5 37.75,31 33.85,27.1 33.85,21.45 v34.85,20.45
BTN_CENTER  (via drill 0.2)
  Top 0.127: U4.53 57.75,42.75 58,42.5 58,41.5 58.5,41 58.5,39.75 58.75,39.5 v59,39.5 | v63.75,16 64,15.75 B9.1
  Route2 0.127: v59,39.5 59,39 60.33,37.67 60.33,36.58 63.5,33.41 63.5,16 v63.75,16
BTN_DOWN  (via drill 0.2)
  Top 0.127: U4.28 45.25,42.75 44.5,43.5 v44.5,43.75 | v56,6.5 55.25,5.75 55.25,5.5 B10.2
  Route2 0.127: v44.5,43.75 42,41.25 42,41 39.75,38.75 39.25,38.75 39,38.5 39,32.5 41,30.5 41,21.5 v56,6.5
BTN_LEFT  (via drill 0.2)
  Top 0.127: U4.51 54.75,41.75 54.5,41.5 v54.5,41 | v51,15.75 50.25,15 50,15 B7.1
  Bottom 0.127: v54.5,41 54.5,19.25 v51,15.75
BTN_RIGHT  (via drill 0.2)
  Top 0.127: U4.52 54.25,42.25 v54,42 | v53.5,12.75 53.75,12.5 B8.2
  Bottom 0.127: v54,42 53.25,42 50.25,39 50.25,35 54,31.25 54,19.25 51,16.25 50.75,16.25 50.5,16 50.5,14.75 52.5,12.75 v53.5,12.75
BTN_UP  (via drill 0.2)
  Top 0.127: U4.50 57.75,41.25 58,41 58,39.5 v57.5,39 | v56,20.5 55.25,19.75 55.25,19.5 B6.2
  Bottom 0.127: v57.5,39 55,36.5 55,21.5 v56,20.5
CLK_NEG
  Top 0.127: U4.56 59.52,44.25 Y1.1 60.95,40.7 C15.1
CLK_POS
  Top 0.127: U4.57 58.62,44.75 Y1.3 60.75,46.88 C14.1
D_PITCH  (via drill 0.2)
  Top 0.127: R6.7 58.5,53.85 58.6,53.75 58.6,53.45 58.7,53.35 R6.1
  Top 0.152: U4.2 54.75,48.15 v54.4,47.8 | v57.15,52.85 57.15,53.55 57.45,53.85 R6.7
  Route2 0.152: v54.4,47.8 56.9,47.8 57.15,48.05 v57.15,52.85
D_ROLL
  Top 0.127: R6.5 58.5,54.85 58.6,54.75 58.6,54.4 58.65,54.35 R6.3
  Top 0.152: R6.5 56.95,54.85 56.7,54.6 56.7,49.7 56.38,49.38 U4.1
D_THROTTLE  (via drill 0.2)
  Top 0.127: R2.3 44.28,34.15 44.75,34.15 44.8,34.1 44.8,33.8 44.85,33.75 R2.5 47.1,33.75 47.8,34.45 v47.8,35.05 | U4.64 55.5,48.25 53.8,46.55 v53.8,44.1
  Route15 0.127: v53.8,44.1 53.2,43.5 53.2,41.45 47.8,36.05 v47.8,35.05
D_YAW  (via drill 0.2)
  Top 0.127: R2.1 44.28,35.15 44.71,35.15 44.77,35.1 44.77,34.83 44.85,34.75 R2.7 46.5,34.75 46.9,35.15 v46.9,35.8 | U4.63 55.55,47.75 54.4,46.6 v54.4,45.2
  Route15 0.127: v54.4,45.2 53.9,44.7 53.4,44.7 52.5,43.8 52.5,42 46.9,36.4 v46.9,35.8
DTR  (via drill 0.2, 0.25)
  Top 0.127: v73.75,44.5 72.75,44.5 U3.2 | v72.75,40 72.25,39.5 71.5,39.5 U5.14
  Top 0.152: U3.2 72.63,44.45 70.85,44.45 v69.95,45.35
  Bottom 0.127: v73.75,44.5 73.75,42.5 73,41.75 73,40.25 v72.75,40
  Bottom 0.152: v69.95,45.35 69.95,47.89 63.53,54.3 62.3,54.3 61.75,54.85 JP1.DTR
DTR-0  (via drill 0.2)
  Top 0.127: v39.5,38.25 C1.2 | v70,40 70.25,40.25 71.25,40.25 U5.15
  Route2 0.127: v70,40 58.75,40 57.92,39.17 57.92,38.83 57.59,38.5 54.5,38.5 53.5,37.5 40.25,37.5 v39.5,38.25
DTR-1  (via drill 0.2)
  Top 0.127: v70,38.75 71.25,38.75 U5.13 | v34.25,61.25 33.75,60.75 15.75,60.75 12.5,57.5 12.5,52 12,51.5 11,51.5 10.75,51.25 10.75,50.25 J6.DTR
  Route15 0.127: v70,38.75 67.75,38.75 58.42,48.08 58.42,48.17 56.59,50 45.11,50 34.25,60.86 v34.25,61.25
E1-A  (via drill 0.2)
  Top 0.127: U4.40 51.25,37.75 50,36.5 v50,34.5
  Route15 0.127: v50,34.5 50,17.25 38.75,6 38.75,4.25 38,3.5 E1.A
E1-B  (via drill 0.2)
  Top 0.127: U4.41 51.75,37.75 50.5,36.5 50.5,34.75 52.35,32.9 52.35,29.6 v52.4,29.55
  Bottom 0.127: v52.4,29.55 53.5,28.45 53.5,19.25 51,16.75 50.75,16.75 50,16 50,10 E1.B
E1-BUT  (via drill 0.2)
  Top 0.127: U4.27 49.25,43.25 v50,42.5
  Bottom 0.127: v50,42.5 50,39.25 49.75,39 49.75,35 49.5,34.75 49.5,28.25 38.75,17.5 E1.BUTA
GND  (via drill 0.2, 0.25, 0.35, 0.38)
  Top 0.127: U3.26 v66.4,45.08 | U3.25 v67.02,45.73 | U3.21 v66.4,48.33 | U3.18 v66.4,50.27 | U3.7 v71.6,47.67 | J5.G1 v29.85,36.17 | J5.G2 v29.85,24.82 | J5.1 v29.75,33.59 | J5.4 v29.75,29.89 | J7.1 v51.25,27.41 | J7.4 v51.25,31.11 | J7.G1 v51.15,24.82 | J7.G2 v51.15,36.17 | U2.2 v12.85,36.5 | B7.3 v51.85,14.6 | B7.4 v51.85,7.4 | B6.4 v56.05,16.5 | B6.3 v60.95,16.5 | B4.2 v25.05,16.5 | B4.1 v29.95,16.5 | J4.6 v38.54,48.11 | U5.8 v66.77,36.23 | B5.2 v25.05,7.5 | B5.1 v29.95,7.5 | B8.4 v56.05,9.5 | B8.3 v60.95,9.5 | B10.4 v56.05,2.5 | B10.3 v60.95,2.5 | B9.3 v65.85,14.6 | B9.4 v65.85,7.4 | S2.1 v76.95,8.5 | U4.20 v47.75,46.75 | U4.24 v47.75,44.75 | U4.61 v55.25,46.75 55.25,45.45 55.52,45.17 | U4.45 v53.75,40.75 | U4.35 v48.75,40.75 47.75,40.75 47.7,40.7 47.7,39.67 U4.33 | B1.3 v17.85,14.6 | B1.4 v17.85,7.4 | C12.2 v41.38,41 | R3.4 v37.13,29.25 | C16.2 v61.61,38.5 | C5.2 v9,38.12 | C6.2 v16,38.12 | D1.C1 v11.7,6.27 | C8.2 v63,45.62 | R5.1 v37.13,35.25 | R5.2 v36.39,34.75 | R1.2 v33.13,39.25 | R1.3 v32.39,38.75 | J6.GND v6.29,50.19 | R4.1 v33.13,35.25 | R4.2 v32.39,34.75 | C13.2 v61.61,49.5 | C9.2 v74,41.62 | C11.2 v41.38,47 | 50.95,48.4 51,48.35 v51,47.2 | R2.6 v46.55,34.25 | v57.15,54.35 57.2,54.4 57.93,54.4 R6.6
  Top 0.152: U4.10 50.82,49.31 50.82,48.53 50.95,48.4 | 50.95,48.4 52.05,48.4 52.18,48.53 52.18,49.31 U4.7 52.32,49.45 52.32,50.27 52.7,50.65 54.06,50.65 55,51.59 55,52.11 54.88,52.23 54.57,52.23 B2.5 54.57,52.77 54.88,52.77 55.25,53.14 C2.2 | 50.95,48.4 50.45,48.4 50.32,48.53 50.32,49.31 U4.11 50.25,50.5 C3.1 | C3.1 48.75,54.09 L1.GND2 | C15.2 59.25,41.2 58.34,42.11 58.34,43.54 58.4,43.6 58.25,43.75 U4.55 56.31,43.82 55.53,43.82 55.4,43.95 55.4,45.05 55.52,45.17 55.53,45.18 56.31,45.18 U4.58 58.09,45.25 58.34,45.5 58.34,45.89 59.25,46.8 C14.2 | C3.1 v47.4,52 | J1.6 64.3,56.73 64.3,56.8
  Top 0.254: C4.1 60.24,53.25 v59.85,52.86 | C17.1 v49.1,19.7
  Top 0.508: U1.2 v42.95,23.95 | C10.1 40.75,23.25 v42.05,21.95
  Bottom 0.127: v41.38,47 41.63,46.75 v47.75,46.75 47.92,46.92 50.72,46.92 v51,47.2
  Bottom 0.152: JP1.GND 74.45,54.45 v74.5,54.4 | v51.25,27.41 50.6,26.76 50.6,25.37 v51.15,24.82
  other vias: 73.1,57.07
  pour Bottom: 18,36 6.5,36 6.5,33.5 18,33.5
  pour Top (isolate 0.254, rank 2): 50.5,58.5 -5,58.5 -5,-1 86,-1 86,62 72,62 72,60 63,60 63,58.5 56.5,58.5
  pour Route2 (isolate 0.254): -7,58.5 88,58.5 88,-3 -7,-3
HIGH-I-GND
  Bottom 0.508: B3.1 19.77,46.27 19.5,46 F1.1
HIGH-V  (via drill 0.38)
  Top 0.508: J8.1 25.5,48.77 v25.5,27.75
  Bottom 0.508: v25.5,27.75 25.5,26 30.75,20.75 30.75,20 J9.2
LCD_RX  (via drill 0.2)
  Top 0.127: v38,41.25 34.25,41.25 31.75,43.75 31.75,51.75 32.25,52.25 32.25,54.75 33.25,55.75 35.5,55.75 35.75,56 35.75,57.5 L1.RXI | v45.5,40.25 45.5,40.5 45.75,40.75 U4.32
  Bottom 0.127: v38,41.25 39,40.25 v45.5,40.25
LCD_TX  (via drill 0.2)
  Top 0.127: v41.25,50.75 39.5,52.5 38.5,52.5 38.25,52.75 38.25,54.25 L1.TX0 | v42,50 42,48.75 43,47.75 43,44.5 45.5,42 45.5,41.5 45.75,41.25 U4.31
  Bottom 0.127: v42,50 v41.25,50.75
MISO  (via drill 0.2)
  Top 0.127: U4.39 50.75,41.25 50.5,41.5 49.25,41.5 v48.25,42.5 | v38,42.75 37,41.75 34.25,41.75 33.5,42.5 33.5,44.75 J4.1
  Bottom 0.127: v48.25,42.5 48,42.75 v38,42.75
MOSI  (via drill 0.2)
  Top 0.127: U4.38 50.25,37.75 50,37.5 47,37.5 44.75,39.75 43.5,39.75 43,40.25 43,42 v41.25,43.75 | v37,48.25 36.75,48 36.25,48 36,48.25 J4.4
  Bottom 0.127: v41.25,43.75 40.75,43.75 37,47.5 v37,48.25
N$1  (via drill 0.2)
  Top 0.127: R4.4 32.75,33.75 v32.75,34 | v22.5,23.75 20,21.25 20,21 19.5,20.5 19.5,19.5 17.5,17.5 17.5,15 17,14.5 17,13.75 13.25,10 11.25,10 11,9.75 11,7.75 D1.A1
  Route2 0.127: v32.75,34 32.75,33.75 30,31 29.75,31 v22.5,23.75
N$2  (via drill 0.2)
  Top 0.127: R4.3 34.25,34.25 34.5,34 34.5,33.5 35,33 v35,32.75 | v32.25,20.75 32.25,19.5 29.5,16.75 29.5,14.25 29,13.75 29,6.75 23.5,1.25 13.25,1.25 10,4.5 10,6.25 D1.C2
  Bottom 0.127: v35,32.75 32.95,30.7 32.95,21.45 v32.25,20.75
N$3  (via drill 0.2)
  Top 0.127: R5.3 36.75,34.25 36.75,33 v37.25,32.5 | v71.5,8.75 72,8.25 72,7.75 D5.A1
  Route2 0.127: v47.25,27 47.5,27 49.75,24.75 50.5,24.75 65,10.25 68.75,10.25 70.25,8.75 70.25,8.5 70.5,8.25 71,8.25 v71.5,8.75
  Bottom 0.127: v37.25,32.5 37.5,32.75 40.25,32.75 46,27 v47.25,27
N$4  (via drill 0.2)
  Top 0.127: v40.25,35.25 R5.8 | v70.5,13 71,12.5 D6.C2
  Route2 0.127: v40.25,35.25 41,35.25 42,34.25 42,34 49.75,26.25 51.5,26.25 60.62,17.12 61.38,17.12 62.5,16 62.5,15 64.5,13 v70.5,13
N$5  (via drill 0.2)
  Top 0.127: v40.75,34.75 R5.7 | v71.5,11.25 72,11.75 72,12.25 D6.C1
  Route2 0.127: v40.75,34.75 49.75,25.75 51.5,25.75 60.5,16.75 60.5,15.75 65,11.25 v71.5,11.25
N$6  (via drill 0.2)
  Top 0.127: R4.7 34.75,34.75 34.5,35 v34.5,35.75 | v21,25 17.75,21.75 15.75,21.75 14.5,20.5 14.5,19.5 12.25,17.25 12.25,13 11.25,12 11,12 10.75,12.25 D4.C1
  Bottom 0.127: v34.5,35.75 34.5,32.75 33.75,32 28.5,32 21.5,25 v21,25
N$7  (via drill 0.2)
  Top 0.127: R5.4 37.25,33.75 v37.25,33.25 | v70.75,8.75 71,8.5 71,7.75 D5.A2
  Route2 0.127: v46.75,27.5 47.5,27.5 49.75,25.25 51.5,25.25 55.5,21.25 55.5,20.25 65,10.75 68.75,10.75 v70.75,8.75
  Bottom 0.127: v37.25,33.25 40.25,33.25 46,27.5 v46.75,27.5
N$8  (via drill 0.2)
  Top 0.127: v70.5,14.5 71,14 71,13.75 D6.A2 | v49.25,47.5 49,47.5 48.75,47.75 U4.14
  Route2 0.127: v49.25,47.5 v56.5,40.25
  Bottom 0.127: v70.5,14.5 70.5,25.75 57.75,38.5 58,38.75 58,39.25 57,40.25 v56.5,40.25
N$9  (via drill 0.2)
  Top 0.127: v72,14.75 72,13.75 D6.A1 | v48.75,46.5 48.25,47 U4.15
  Route15 0.127: v72,14.75 72.25,15 72.25,18 70.25,20 70.25,25.5 55,40.75 55,45.7 54.7,46 49.25,46 v48.75,46.5
N$11  (via drill 0.2)
  Top 0.127: 35.75,33.75 R4.5 | 35.75,33.75 35.75,34.25 R4.6 | 35.75,33.75 35.75,32.75 35.25,32.25 34.25,32.25 v33.75,32.75 | v24.75,32.5 17.5,32.5 16.25,33.75 15.5,33.75 14,35.25 14.25,35.5 14,35.75 U2.1
  Bottom 0.127: v33.75,32.75 33.5,32.5 v24.75,32.5
N$12
  Top 0.127: R1.6 34.75,38.75 34.5,39 34.5,40 34,40.5 34,41 31.25,43.75 31.25,49.25 27.5,53 24,53 23,54 17,54 13.5,50.5 13.5,48.75 12.5,47.75 12.5,37.25 12,36.75 12,36.5 11.25,35.75 U2.5
N$13  (via drill 0.2)
  Top 0.127: v33.75,36 34,36.25 34.75,36.25 35,36 35,35.25 R4.8 | v18.75,27.5 12.5,21.25 12.5,21 12,20.5 12,19.75 9.5,17.25 9.5,13.25 10.25,12.5 D4.C2
  Bottom 0.127: v33.75,36 30.75,36 27.75,33 24.25,33 v18.75,27.5
N$14
  Top 0.508: S1.7 5,13.5 5,14.75 3.5,16.25 3.5,20 5.5,22 6.25,22 12.25,28 14.5,28 D2.2
N$20
  Top 0.127: C11.1 43.75,45.75 44,45.5 44.25,45.5 44.5,45.75 U4.22 48.25,45.75 48.5,46 48.25,46.25 U4.21
N$21
  Top 0.127: U4.60 57.75,46.25 58.5,47 58.5,48.25 58.75,48.25 59.25,48.75 C13.1
PITCH  (via drill 0.2)
  Top 0.127: J7.5 51.26,32.34 51.75,31.85 51.75,29 v52.15,28.6
  Top 0.152: v67.35,53.45 66.55,54.25 60.25,54.25 59.85,53.85 R6.2
  Top 0.2: v59.95,28.6 76.1,28.6 J3.V
  Route15 0.127: v52.15,28.6 v59.95,28.6
  Bottom 0.2: J3.V 77.2,31 76.25,31.95 76.25,49.7 74.3,51.65 69.15,51.65 v67.35,53.45
PROG_SEL  (via drill 0.2)
  Top 0.127: 69.25,38.25 68.75,38.75 65.75,38.75 U5.4 | 69.25,38.25 71.25,38.25 U5.12 | S2.2 75.25,11 75.25,11.5 v74.75,12 | 69.25,38.25 v69.25,36
  Bottom 0.127: v74.75,12 75.5,12.75 75.5,23 71.25,27.25 71.25,34 v69.25,36
RESET  (via drill 0.2)
  Top 0.127: U4.12 49.75,46.75 v48.25,45.25 | v39.75,45.5 38.5,45.5 38.5,45 J4.5 38.5,44.75 C1.1 37,39.75 36.75,39.5 37.25,39 36.25,38 36.25,35.25 35.75,34.75 36.25,34.25 36.25,32.75 36,32.5 36,31 | R3.1 36.25,30.75 36,31 | B1.1 16,18.5 17,19.5 17,20.5 21,24.5 v21.5,24.5 | v26.25,28.5 27.8,28.5 30.2,26.1 35.5,26.1 36.3,26.9 36.3,28.1 35,29.4 35,30.3 35.7,31 36,31
  Bottom 0.127: v48.25,45.25 47.75,45.75 40,45.75 v39.75,45.5 | v21.5,24.5 25.5,28.5 v26.25,28.5
RF  (via drill 0.2)
  Top 0.127: v12,19 11.75,19 10,17.25 10,13.75 D4.A2 | v44.5,48 46.75,50.25 47.75,50.25 U4.16
  Route2 0.127: v12,19 12,20.25 11.75,20.5 18.33,27.08 18.92,27.08 19.17,27.33 19.17,27.51 28.58,36.92 39.66,48 v44.5,48
RF_N
  Top 0.152: U4.9 51.25,50.73 52.38,51.85 B2.3
RF_P
  Top 0.152: U4.8 51.75,50.41 52.63,51.28 53.41,51.28 53.98,51.85 B2.4
ROLL  (via drill 0.2)
  Top 0.127: J7.2 51.09,28.66 v51.7,28.05
  Top 0.152: v67.4,54.45 67.05,54.8 59.27,54.8 R6.4
  Top 0.2: J3.H 74.9,33.4 62.35,33.4 v56.75,27.8
  Route15 0.127: v51.7,28.05 51.95,27.8 v56.75,27.8
  Bottom 0.2: v67.4,54.45 69.45,52.4 74.65,52.4 77.05,50 77.05,37.55 77.6,37 J3.H
RXI  (via drill 0.2)
  Top 0.127: v73.75,46.45 73.7,46.4 72.67,46.4 U3.5 | v72.75,37.5 72.25,37 71.5,37 U5.10
  Bottom 0.127: v73.75,46.45 73.25,45.95 73.25,42.5 72,41.25 72,38.25 v72.75,37.5
  Bottom 0.152: JP1.RXI 64.29,54.26 70.5,48.05 70.5,47.1 71.15,46.45 v73.75,46.45
RXI-0  (via drill 0.2)
  Top 0.127: U4.47 54.75,38.75 55,38.5 57.5,38.5 58.25,37.75 v61.75,37.75 | v70,37.5 71.25,37.5 U5.11
  Bottom 0.127: v61.75,37.75 66.5,37.75 66.75,37.5 v70,37.5
RXI-1  (via drill 0.2)
  Top 0.127: v70.25,35.75 70.75,36.25 71.25,36.25 U5.9 | v33.5,61.25 15.75,61.25 10.75,56.25 10.75,54.25 J6.RXI
  Route15 0.127: v33.5,61.25 45.25,49.5 54.5,49.5 54.5,49 57.33,46.17 57.69,46.17 67.36,36.5 68,36.5 69.5,35 v70.25,35.75
RXLED  (via drill 0.2)
  Top 0.127: v70.5,7 71,6.5 D5.C2 | v66.5,47.25 66,47.75 65.5,47.75 U3.22
  Route2 0.127: v71.75,35.5 71.5,35.75 71.5,36.75 71,37.25 71,40.25 67.5,43.75 67.5,46.25 v66.5,47.25
  Bottom 0.127: v70.5,7 76,12.5 76,23 71.75,27.25 v71.75,35.5
SCK
  Top 0.127: U4.37 49.75,38 47,38 45,40 45,40.75 45.25,41 45,41.25 45,42 40.75,46.25 40.75,49.5 46.75,55.5 46.75,58.25 46.25,58.75 39.25,58.75 32.25,51.75 32.25,48 32.5,47.75 33.5,47.75 34.25,47 35.75,47 36,46.75 J4.3
THROTTLE  (via drill 0.2)
  Top 0.127: v34.8,26.9 33.04,28.66 J5.5 29.24,28.66 27.8,30.1 v27.8,34 | v44.2,32.9 44.18,32.92 R2.4
  Route15 0.127: v34.8,26.9 35.7,26 43.4,26 44.2,26.8 v44.2,32.9
  Route15 0.2: v27.8,34 20.4,41.4 10.1,41.4 J2.V
TXLED  (via drill 0.2)
  Top 0.127: v72.5,7 72,6.5 D5.C1 | v64.25,46.75 64.5,47 65.25,47 U3.23
  Route2 0.127: v72.5,7 72.5,18.75 75.25,21.5 75.25,24.25 71.5,28 71.5,35 71.25,35.25 71.25,35.5 71,35.75 71,36.75 70.5,37.25 70.5,40.25 64.25,46.5 v64.25,46.75
TXO  (via drill 0.2)
  Top 0.127: v67,38 66.5,37.5 65.75,37.5 U5.6
  Top 0.152: v69,50.7 69,44.2 69.42,43.77 U3.1 | U3.1 | v71.9,42.45 72.15,42.45 72.65,42.95 U3.1
  Bottom 0.127: v67,38 67.05,38 71.5,42.45 v71.9,42.45
  Bottom 0.152: v69,50.7 66.58,53.12 66.58,56.59 JP1.TXO
TXO-0  (via drill 0.2)
  Top 0.127: U4.46 54.25,38.25 54.5,38 57.5,38 58.25,37.25 v61.25,37.25 | v64.25,37.25 64.5,37 65.5,37 U5.7
  Bottom 0.127: v64.25,37.25 v61.25,37.25
TXO-1  (via drill 0.2)
  Top 0.127: v64.25,38.25 65.5,38.25 U5.5 | v9.25,61.25 9.25,57.25 8.25,56.25 8.25,54.25 J6.TXO
  Bottom 0.127: 63.5,38.25 v64.25,38.25 | 49.75,48 39,58.75 35,58.75 32.5,61.25 v9.25,61.25
  Bottom 0.152: 49.75,48 51.35,48 52.15,47.2 52.15,44.6 53.8,42.95 56.65,42.95 59.6,40 61.75,40 63.5,38.25
USB_D_N
  Top 0.127: J1.2 68.65,53.05 67.17,51.58 U3.16
USB_D_P
  Top 0.127: J1.3 68,53.05 67.17,52.23 U3.15
VBAT  (via drill 0.35, 0.38)
  Top 0.254: R3.6 40.25,29.75 v40.5,30
  Top 0.508: S1.3 v2.06,13.5 1.25,13.5 0.75,14 0.75,24.5 3.5,27.25 6.5,27.25 7.25,28 8,28 8,28.25 | v9.5,27.02 D3.2 9.25,28 8.25,28 8,28.25 | v40.5,30 41.25,29.25 41.25,28.75 34.65,22.15 26.1,22.15 15.75,32.5 8.25,32.5 8,32.25 8,28.25
VBUS  (via drill 0.35, 0.38)
  Top 0.254: R3.5 40.25,29.25 v40.5,29
  Top 0.508: S1.6 v6.94,11 7.75,11 8,11.25 10,9.25 10,7.75 D1.A2 v9.21,7.73 9,7.5 8.75,7.25 8.75,5 13,0.75 36.5,0.75 | U2.4 v10.16,37.45 | J1.1 v69.3,54.48 69.25,54.35 69.25,53.75 69.5,53.5 79.25,53.5 80.25,52.5 80.25,7.5 73.5,0.75 36.5,0.75 | 7.25,35.75 C5.1 | 6.5,36.5 7.25,35.75 | 7.25,35.75 7.25,34 8,33.25 16,33.25 26.45,22.8 34.3,22.8 v40.5,29 | v39.7,21.9 36,18.2 36,14.25 37.5,12.75 37.5,4.5 36.5,3.5 36.5,0.75
  Bottom 0.508: v40.5,29 39.7,28.2 v39.7,21.9
  pour Top: 11.5,36.5 6.5,36.5 6.5,40 11.5,40
  pour Bottom: 11.5,36.5 6.5,36.5 6.5,40 11.5,40
VIN
  Top 0.508: L1.RAW 46,57.5 46,56.25 45.75,56 37.25,56 33.5,52.25 33.5,50.25 J4.2 33.5,50 33.5,48.5 34.5,47.5 38.75,47.5 40.5,45.75 40.5,36.25 41.5,35.25 41.5,30 42,29.5 42,28.5 39.75,26.25 39.75,26 | U3.20 65.25,49 64.5,49 64,48.5 64,48 63.5,47.5 63.5,47.25 63.25,47.25 C7.1 62.5,47.25 62.5,46 62,45.5 62,43.5 62.25,43.25 C8.1 62.5,43 62.5,37.5 51,26 41.9,26 | D3.1 9.5,31 14.5,31 D2.1 14.75,31 16.25,31 23.5,23.75 23.5,23.5 | 23.5,23.5 23.5,20 J9.5 | 39.75,26 39.5,26 35,21.5 25.75,21.5 23.75,23.5 23.5,23.5 | 39.75,26 41.9,26 | U1.1 41.9,24.9 | U1.3 42.45,23 41.9,23.55 41.9,24.9 | 41.9,24.9 41.9,26 | 41.9,24.9 C10.2
YAW  (via drill 0.2)
  Top 0.127: v35.6,27.5 34.1,29 34.1,30.5 32.26,32.34 J5.2 30.86,32.3 29.2,32.3 28.8,32.7 28.8,34.2 28.3,34.7 27.6,34.7 v26.6,33.7 | v43.1,34.7 44.13,34.7 R2.2
  Route15 0.127: v35.6,27.5 36.3,26.8 42.2,26.8 43.1,27.7 v43.1,34.7
  Route15 0.2: v26.6,33.7 19.8,40.5 5,40.5 J2.H

### Text on the board
tPlace: CSE176e / Remote | B | G | + | - | Ignore eight drills outside of board area | TX | RX | Ignore four drills outside of board area | O | Y | B | G | GND | DTR | - | + | Servo / Battery | Steven Swanson / J. Garza | servo | ~ | ~ | ~ | ~ | GND | 34 | 35 | A4 | A5 | VIN | 3V3 | GND | VHI | 19 | ON | QUAD | RX/TX | PWR | STATUS | BTN1 | FTDI RX | FTDI TX | CHARGE | DONE | OFF | RST | RC | BTN2 | Mark IV | Rev 12
Document: Mounting w/o LCD: / 1.6mm controller board / 9mm standoff (3x donuts) / 3mm baseplate / 1.6mm runout / 15.2mm total / ~5/8in total | Mounting w/ LCD: / 1.6mm LCD / 12mm standoff (4x) / 1.6mm controller board / 9mm standoff (3x donuts) / 3mm baseplate / 1.6mm nut / 28.8 mm total / ~1 1/4 in | B and G on top / O and Y below | The mounting holes will accomodate FrSky M7 and M9 gimbals. / They can be mounted with m3x0.5 machine screws and 1" spacers. | Mounting gimbals: / 1in standoffs.
baseplateart: CSE176e | <--THROTTLE--> | <--PITCH--> | To achieve great things, two things are needed: a plan and not quite enough time. / --Leonard Bernstein | <--YAW--> | <--ROLL-->